# EAGLE design OpenLegDrive_G4 (EAGLE 9.6.2)

## Sheet 1 of 5
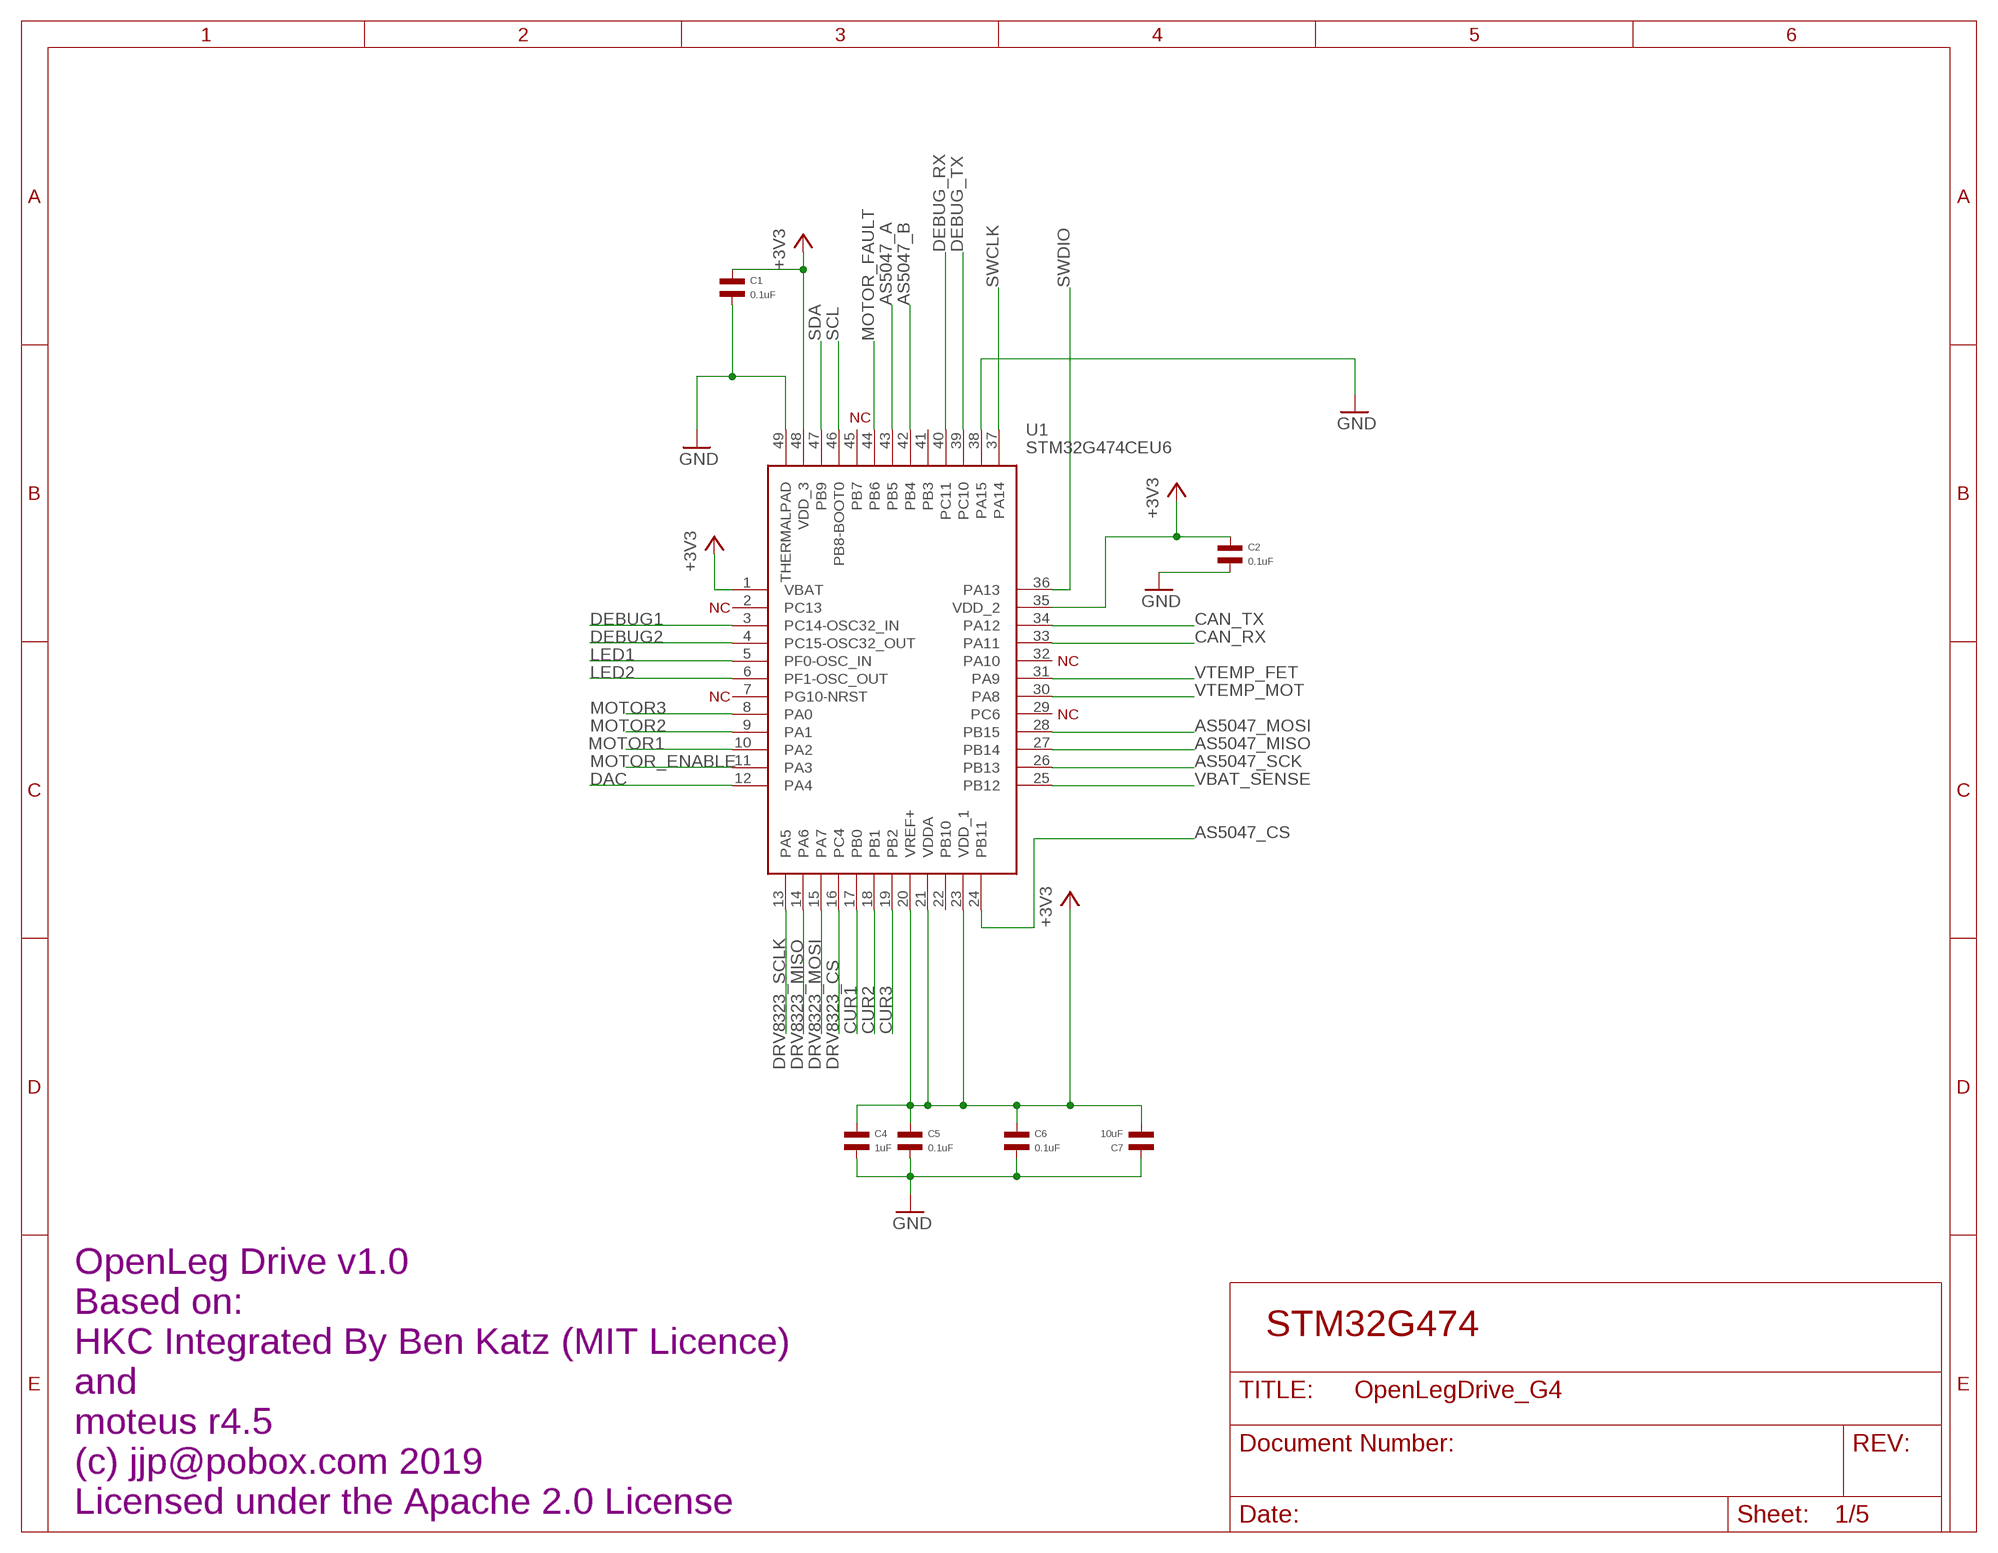
[diagram p0: schematic, sheet 1]

### Parts
C1  0.1uF  CAPACITOR_NP_0402  [C0402]
C2  0.1uF  CAPACITOR_NP_0402  [C0402]
C4  1uF  CAPACITOR_NP_0402  [C0402]
C5  0.1uF  CAPACITOR_NP_0402  [C0402]
C6  0.1uF  CAPACITOR_NP_0402  [C0402]
C7  10uF  CAPACITOR_NP_1206  [C1206]
U1  STM32G474CEU6  [QFN50P700X700X60-49N]

### Nets
3V3: C1.P$1 C2.P$1 C4.P$1 C5.P$1 C6.P$1 C7.P$2 U1.1(VBAT) U1.20(VREF+) U1.21(VDDA) U1.23(VDD_1) U1.35(VDD_2) U1.48(VDD_3) ; supply symbol labelled +3V3 ; also sheet 2,3,4,5
AS5047_A: U1.43(PB5) ; also sheet 4
AS5047_B: U1.42(PB4) ; also sheet 4
AS5047_CS: U1.24(PB11) ; also sheet 4
AS5047_MISO: U1.27(PB14) ; also sheet 4
AS5047_MOSI: U1.28(PB15) ; also sheet 4
AS5047_SCK: U1.26(PB13) ; also sheet 4
CAN_RX: U1.33(PA11) ; also sheet 3
CAN_TX: U1.34(PA12) ; also sheet 3
CUR1: U1.17(PB0) ; also sheet 2
CUR2: U1.18(PB1) ; also sheet 2
CUR3: U1.19(PB2) ; also sheet 2
DAC: U1.12(PA4)
DEBUG1: U1.3(PC14-OSC32_IN) ; also sheet 3
DEBUG2: U1.4(PC15-OSC32_OUT) ; also sheet 3
DEBUG_RX: U1.40(PC11) ; also sheet 3
DEBUG_TX: U1.39(PC10) ; also sheet 3
DRV8323_CS: U1.16(PC4) ; also sheet 2,3
DRV8323_MISO: U1.14(PA6) ; also sheet 2,3
DRV8323_MOSI: U1.15(PA7) ; also sheet 2,3
DRV8323_SCLK: U1.13(PA5) ; also sheet 2,3
GND: C1.P$2 C2.P$2 C4.P$2 C5.P$2 C6.P$2 C7.P$1 U1.38(PA15) U1.49(THERMALPAD) ; also sheet 2,3,4,5
LED1: U1.5(PF0-OSC_IN) ; also sheet 3
LED2: U1.6(PF1-OSC_OUT) ; also sheet 3
MOTOR1: U1.10(PA2) ; also sheet 2,3
MOTOR2: U1.9(PA1) ; also sheet 2,3
MOTOR3: U1.8(PA0) ; also sheet 2,3
MOTOR_ENABLE: U1.11(PA3) ; also sheet 2
MOTOR_FAULT: U1.44(PB6) ; also sheet 2
SCL: U1.46(PB8-BOOT0) ; also sheet 3
SDA: U1.47(PB9) ; also sheet 3
SWCLK: U1.37(PA14) ; also sheet 3
SWDIO: U1.36(PA13) ; also sheet 3
VBAT_SENSE: U1.25(PB12) ; also sheet 5
VTEMP_FET: U1.31(PA9) ; also sheet 5
VTEMP_MOT: U1.30(PA8) ; also sheet 5
Unconnected: U1.2(PC13) U1.7(PG10-NRST) U1.22(PB10) U1.29(PC6) U1.32(PA10) U1.41(PB3) U1.45(PB7)

### Notes on the sheet
- NC
- NC
- NC
- NC
- NC
- STM32G474
- OpenLeg Drive v1.0
  Based on:
  HKC Integrated By Ben Katz (MIT Licence)
  and
  moteus r4.5
  (c) jjp@pobox.com 2019
  Licensed under the Apache 2.0 License

## Sheet 2 of 5
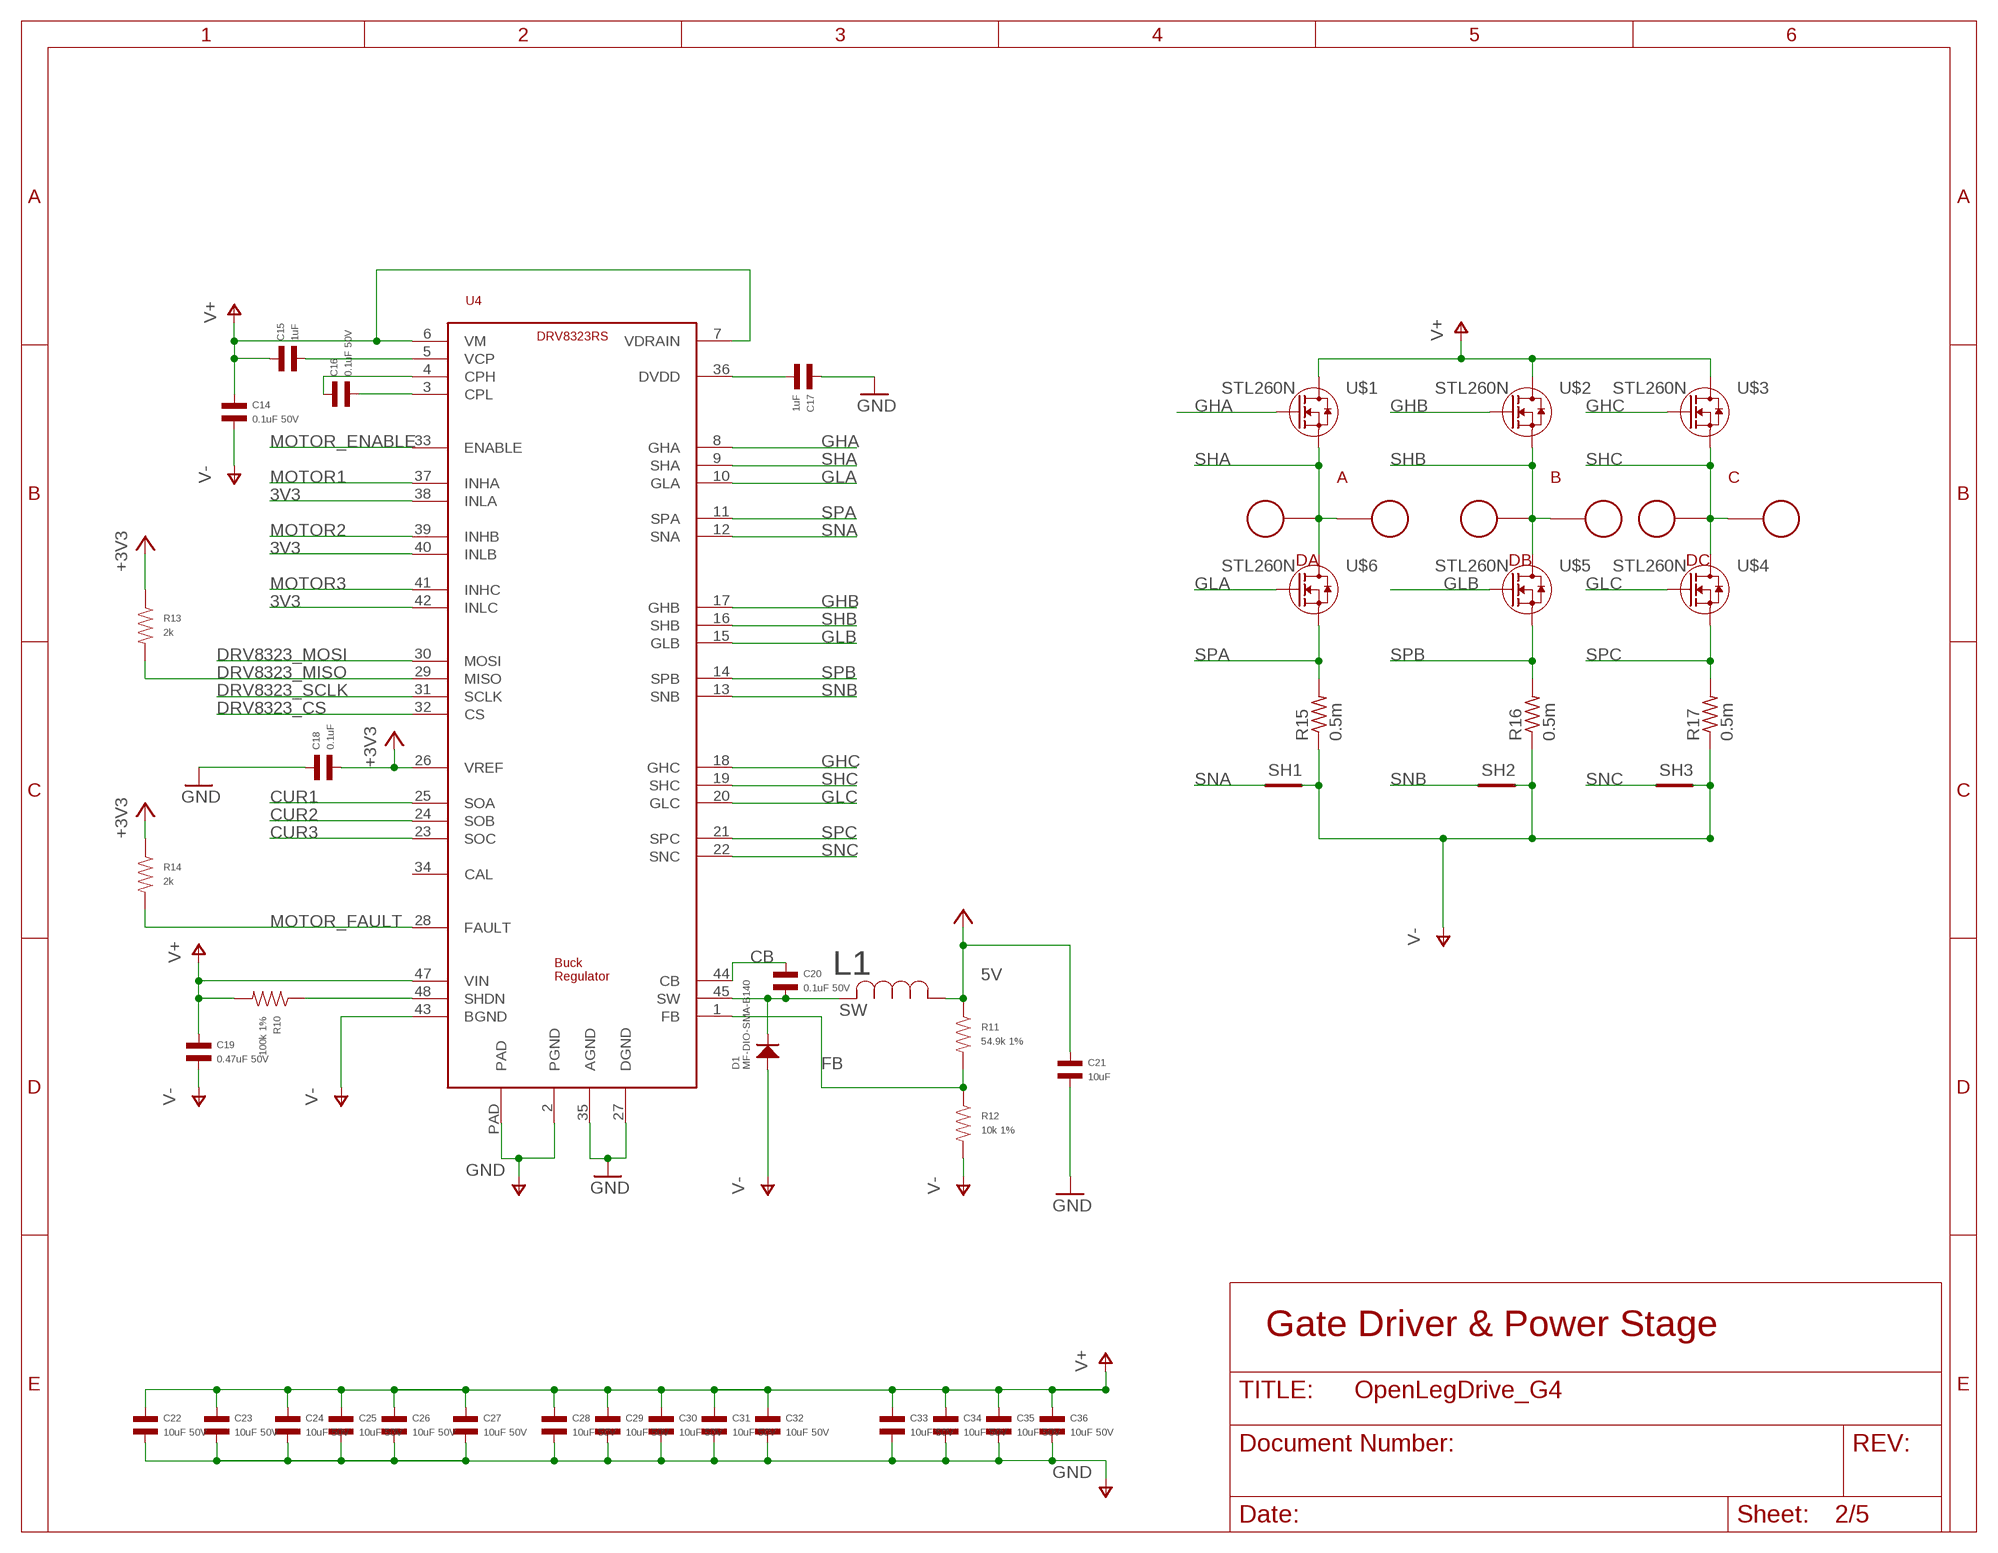
[diagram p1: schematic, sheet 2]

### Parts
A  PAD16AWG_PAD  [16AWG_PAD]
B  PAD16AWG_PAD  [16AWG_PAD]
C  PAD16AWG_PAD  [16AWG_PAD]
C14  0.1uF 50V  CAPACITOR_NP_0402  [C0402]
C15  1uF  CAPACITOR_NP_0402  [C0402]
C16  0.1uF 50V  CAPACITOR_NP_0402  [C0402]
C17  1uF  CAPACITOR_NP_0402  [C0402]
C18  0.1uF  CAPACITOR_NP_0402  [C0402]
C19  0.47uF 50V  CAPACITOR_NP_0402  [C0402]
C20  0.1uF 50V  CAPACITOR_NP_0402  [C0402]
C21  10uF  CAPACITOR_NP_1206  [C1206]
C22  10uF 50V  CAPACITOR_NP_1206  [C1206]
C23  10uF 50V  CAPACITOR_NP_1206  [C1206]
C24  10uF 50V  CAPACITOR_NP_1206  [C1206]
C25  10uF 50V  CAPACITOR_NP_1206  [C1206]
C26  10uF 50V  CAPACITOR_NP_1206  [C1206]
C27  10uF 50V  CAPACITOR_NP_1206  [C1206]
C28  10uF 50V  CAPACITOR_NP_1206  [C1206]
C29  10uF 50V  CAPACITOR_NP_1206  [C1206]
C30  10uF 50V  CAPACITOR_NP_1206  [C1206]
C31  10uF 50V  CAPACITOR_NP_1206  [C1206]
C32  10uF 50V  CAPACITOR_NP_1206  [C1206]
C33  10uF 50V  CAPACITOR_NP_1206  [C1206]
C34  10uF 50V  CAPACITOR_NP_1206  [C1206]
C35  10uF 50V  CAPACITOR_NP_1206  [C1206]
C36  10uF 50V  CAPACITOR_NP_1206  [C1206]
D1  MF-DIO-SMA-B140  DIODES_B140_SMA  [SMA]
DA  PAD24AWG_PAD  [24AWG_PAD]
DB  PAD24AWG_PAD  [24AWG_PAD]
DC  PAD24AWG_PAD  [24AWG_PAD]
L1  SRN4018-220M  [IND_BOURNS_SRN4018]
R10  100k 1%  RESISTOR_0402  [R0402]
R11  54.9k 1%  RESISTOR_0402  [R0402]
R12  10k 1%  RESISTOR_0402  [R0402]
R13  2k  RESISTOR_0402  [R0402]
R14  2k  RESISTOR_0402  [R0402]
R15  0.5m  R-US_R1210  [R1210]
R16  0.5m  R-US_R1210  [R1210]
R17  0.5m  R-US_R1210  [R1210]
SH1  SHORTT5  [SHORT_TOP-50]
SH2  SHORTT5  [SHORT_TOP-50]
SH3  SHORTT5  [SHORT_TOP-50]
U4  DRV8323RS  [PVQFN-N48]
U$1  STL260N  [POWERFLAT_5X6]
U$2  STL260N  [POWERFLAT_5X6]
U$3  STL260N  [POWERFLAT_5X6]
U$4  STL260N  [POWERFLAT_5X6]
U$5  STL260N  [POWERFLAT_5X6]
U$6  STL260N  [POWERFLAT_5X6]

### Nets
3V3: C18.P$2 R13.P$1 R14.P$1 U4.26(VREF) U4.38(INLA) U4.40(INLB) U4.42(INLC) ; supply symbol labelled +3V3 ; also sheet 1,3,4,5
5V: C21.P$1 L1.1 R11.P$1 ; supply symbol labelled +3V3 ; also sheet 3
CB: C20.P$1 U4.44(CB)
CUR1: U4.25(SOA) ; also sheet 1
CUR2: U4.24(SOB) ; also sheet 1
CUR3: U4.23(SOC) ; also sheet 1
DRV8323_CS: U4.32(CS) ; also sheet 1,3
DRV8323_MISO: R13.P$2 U4.29(MISO) ; also sheet 1,3
DRV8323_MOSI: U4.30(MOSI) ; also sheet 1,3
DRV8323_SCLK: U4.31(SCLK) ; also sheet 1,3
FB: R11.P$2 R12.P$1 U4.1(FB)
GHA: U4.8(GHA) U$1.4(G)
GHB: U4.17(GHB) U$2.4(G)
GHC: U4.18(GHC) U$3.4(G)
GLA: U4.10(GLA) U$6.4(G)
GLB: U4.15(GLB) U$5.4(G)
GLC: U4.20(GLC) U$4.4(G)
GND: C14.P$2 C17.P$1 C18.P$1 C19.P$2 C21.P$2 C22.P$2 C23.P$2 C24.P$2 C25.P$2 C26.P$2 C27.P$2 C28.P$2 C29.P$2 C30.P$2 C31.P$2 C32.P$2 C33.P$2 C34.P$2 C35.P$2 C36.P$2 D1.ANODE R12.P$2 R15.1 R16.1 R17.1 SH1.2 SH2.2 SH3.2 U4.2(PGND) U4.27(DGND) U4.35(AGND) U4.43(BGND) U4.PAD ; supply symbol labelled V- ; also sheet 1,3,4,5
MOTOR1: U4.37(INHA) ; also sheet 1,3
MOTOR2: U4.39(INHB) ; also sheet 1,3
MOTOR3: U4.41(INHC) ; also sheet 1,3
MOTOR_ENABLE: U4.33(ENABLE) ; also sheet 1
MOTOR_FAULT: R14.P$2 U4.28(FAULT) ; also sheet 1
N$5: R10.P$1 U4.48(SHDN)
N$10: C16.P$2 U4.3(CPL)
N$13: C16.P$1 U4.4(CPH)
N$14: C15.P$2 U4.5(VCP)
N$16: C17.P$2 U4.36(DVDD)
SHA: A.1 DA.P$1 U4.9(SHA) U$1.1(S) U$1.2(S) U$1.3(S) U$6.5(D) U$6.6(D) U$6.7(D) U$6.8(D)
SHB: B.1 DB.P$1 U4.16(SHB) U$2.1(S) U$2.2(S) U$2.3(S) U$5.5(D) U$5.6(D) U$5.7(D) U$5.8(D)
SHC: C.1 DC.P$1 U4.19(SHC) U$3.1(S) U$3.2(S) U$3.3(S) U$4.5(D) U$4.6(D) U$4.7(D) U$4.8(D)
SNA: SH1.1 U4.12(SNA)
SNB: SH2.1 U4.13(SNB)
SNC: SH3.1 U4.22(SNC)
SPA: R15.2 U4.11(SPA) U$6.1(S) U$6.2(S) U$6.3(S)
SPB: R16.2 U4.14(SPB) U$5.1(S) U$5.2(S) U$5.3(S)
SPC: R17.2 U4.21(SPC) U$4.1(S) U$4.2(S) U$4.3(S)
SW: C20.P$2 D1.CATHODE L1.2 U4.45(SW)
V+: C14.P$1 C15.P$1 C19.P$1 C22.P$1 C23.P$1 C24.P$1 C25.P$1 C26.P$1 C27.P$1 C28.P$1 C29.P$1 C30.P$1 C31.P$1 C32.P$1 C33.P$1 C34.P$1 C35.P$1 C36.P$1 R10.P$2 U4.6(VM) U4.7(VDRAIN) U4.47(VIN) U$1.5(D) U$1.6(D) U$1.7(D) U$1.8(D) U$2.5(D) U$2.6(D) U$2.7(D) U$2.8(D) U$3.5(D) U$3.6(D) U$3.7(D) U$3.8(D) ; also sheet 3,5
Unconnected: U4.34(CAL)

### Notes on the sheet
- Gate Driver & Power Stage

## Sheet 3 of 5
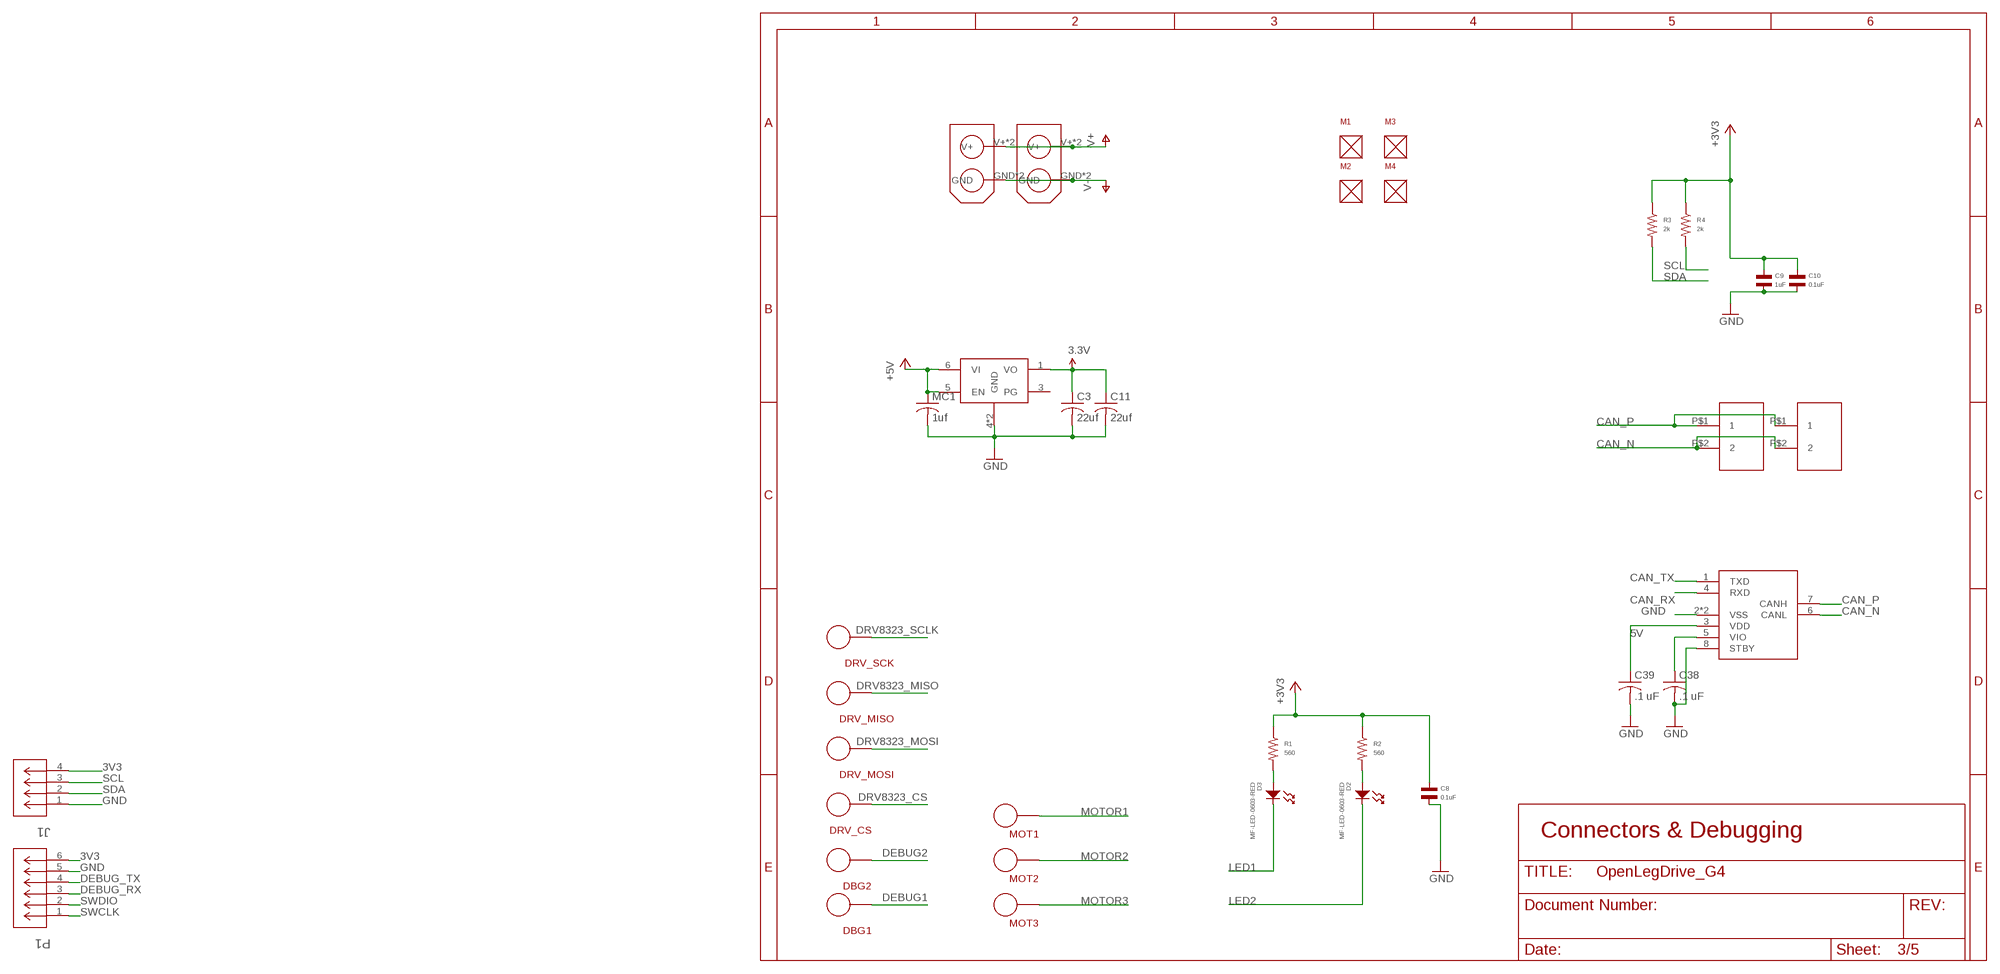
[diagram p2: schematic, sheet 3]

### Parts
C3  22uf  C-USC0603K  [C0603K]
C8  0.1uF  CAPACITOR_NP_0402  [C0402]
C9  1uF  CAPACITOR_NP_0402  [C0402]
C10  0.1uF  CAPACITOR_NP_0402  [C0402]
C11  22uf  C-USC0603K  [C0603K]
C38  .1 uF  C-USC0402K  [C0402K]
C39  .1 uF  C-USC0402K  [C0402K]
D2  MF-LED-0603-RED  LED_SINGLE-0603-RED  [LED0603]
D3  MF-LED-0603-RED  LED_SINGLE-0603-RED  [LED0603]
DBG1  PAD24AWG_PAD  [24AWG_PAD]
DBG2  PAD24AWG_PAD  [24AWG_PAD]
DRV_CS  PAD24AWG_PAD  [24AWG_PAD]
DRV_MISO  PAD24AWG_PAD  [24AWG_PAD]
DRV_MOSI  PAD24AWG_PAD  [24AWG_PAD]
DRV_SCK  PAD24AWG_PAD  [24AWG_PAD]
J1  S4B-ZR(LF)(SN)  [CONN_S4B-ZR(LF)(SN)_JST]
M1  MOUNT  [M2.5MOUNT]
M2  MOUNT  [M2.5MOUNT]
M3  MOUNT  [M2.5MOUNT]
M4  MOUNT  [M2.5MOUNT]
MC1  1uf  C-USC0402  [C0402]
MOT1  PAD24AWG_PAD  [24AWG_PAD]
MOT2  PAD24AWG_PAD  [24AWG_PAD]
MOT3  PAD24AWG_PAD  [24AWG_PAD]
P1  S6B-ZR(LF)(SN)  [S6B-ZR_JST]
R1  560  RESISTOR_0402  [R0402]
R2  560  RESISTOR_0402  [R0402]
R3  2k  RESISTOR_0402  [R0402]
R4  2k  RESISTOR_0402  [R0402]
U$7  XT30_DUAL_MOUNT_FLIPPED  [XT30_DUAL_FLIPPED]
U$8  XT30_DUAL_MOUNT  [XT30_DUAL]
U$9  JST-PH-DOUBLE-2-PIN  [JST-PH_DUALMOUNT-2]
U$10  JST-PH-DOUBLE-2-PIN  [JST-PH_DUALMOUNT-2]
U$11  LDFM  [DFN6-3X3]
U$12  MCP2542  [TDFN]

### Nets
3V3: C3.1 C8.P$1 C9.P$1 C10.P$1 C11.1 C38.1 J1.4 P1.6 R1.P$1 R2.P$1 R3.P$1 R4.P$1 U$11.1(VO) U$12.5(VIO) ; supply symbol labelled 3.3V, +3V3 ; also sheet 1,2,4,5
5V: C39.1 MC1.1 U$11.5(EN) U$11.6(VI) U$12.3(VDD) ; supply symbol labelled +5V ; also sheet 2
CAN_N [CAN]: U$9.P$2 U$10.P$2 U$12.6(CANL)
CAN_P [CAN]: U$9.P$1 U$10.P$1 U$12.7(CANH)
CAN_RX: U$12.4(RXD) ; also sheet 1
CAN_TX: U$12.1(TXD) ; also sheet 1
DEBUG1: DBG1.P$1 ; also sheet 1
DEBUG2: DBG2.P$1 ; also sheet 1
DEBUG_RX: P1.3 ; also sheet 1
DEBUG_TX: P1.4 ; also sheet 1
DRV8323_CS: DRV_CS.P$1 ; also sheet 1,2
DRV8323_MISO: DRV_MISO.P$1 ; also sheet 1,2
DRV8323_MOSI: DRV_MOSI.P$1 ; also sheet 1,2
DRV8323_SCLK: DRV_SCK.P$1 ; also sheet 1,2
GND: C3.2 C8.P$2 C9.P$2 C10.P$2 C11.2 C38.2 C39.2 J1.1 MC1.2 P1.5 U$7.GND U$7.GND@1(GND) U$8.GND U$8.GND@1(GND) U$11.4(GND) U$11.EXP(GND) U$12.2(VSS) U$12.8(STBY) U$12.9(VSS) ; supply symbol labelled V- ; also sheet 1,2,4,5
LED1: D3.CATHODE ; also sheet 1
LED2: D2.CATHODE ; also sheet 1
MOTOR1: MOT1.P$1 ; also sheet 1,2
MOTOR2: MOT2.P$1 ; also sheet 1,2
MOTOR3: MOT3.P$1 ; also sheet 1,2
N$17: D3.ANODE R1.P$2
N$18: D2.ANODE R2.P$2
SCL: J1.3 R4.P$2 ; also sheet 1
SDA: J1.2 R3.P$2 ; also sheet 1
SWCLK: P1.1 ; also sheet 1
SWDIO: P1.2 ; also sheet 1
V+: U$7.V+ U$7.V+@1(V+) U$8.V+ U$8.V+@1(V+) ; also sheet 2,5
Unconnected: U$11.3(PG)

### Notes on the sheet
- Connectors & Debugging

## Sheet 4 of 5
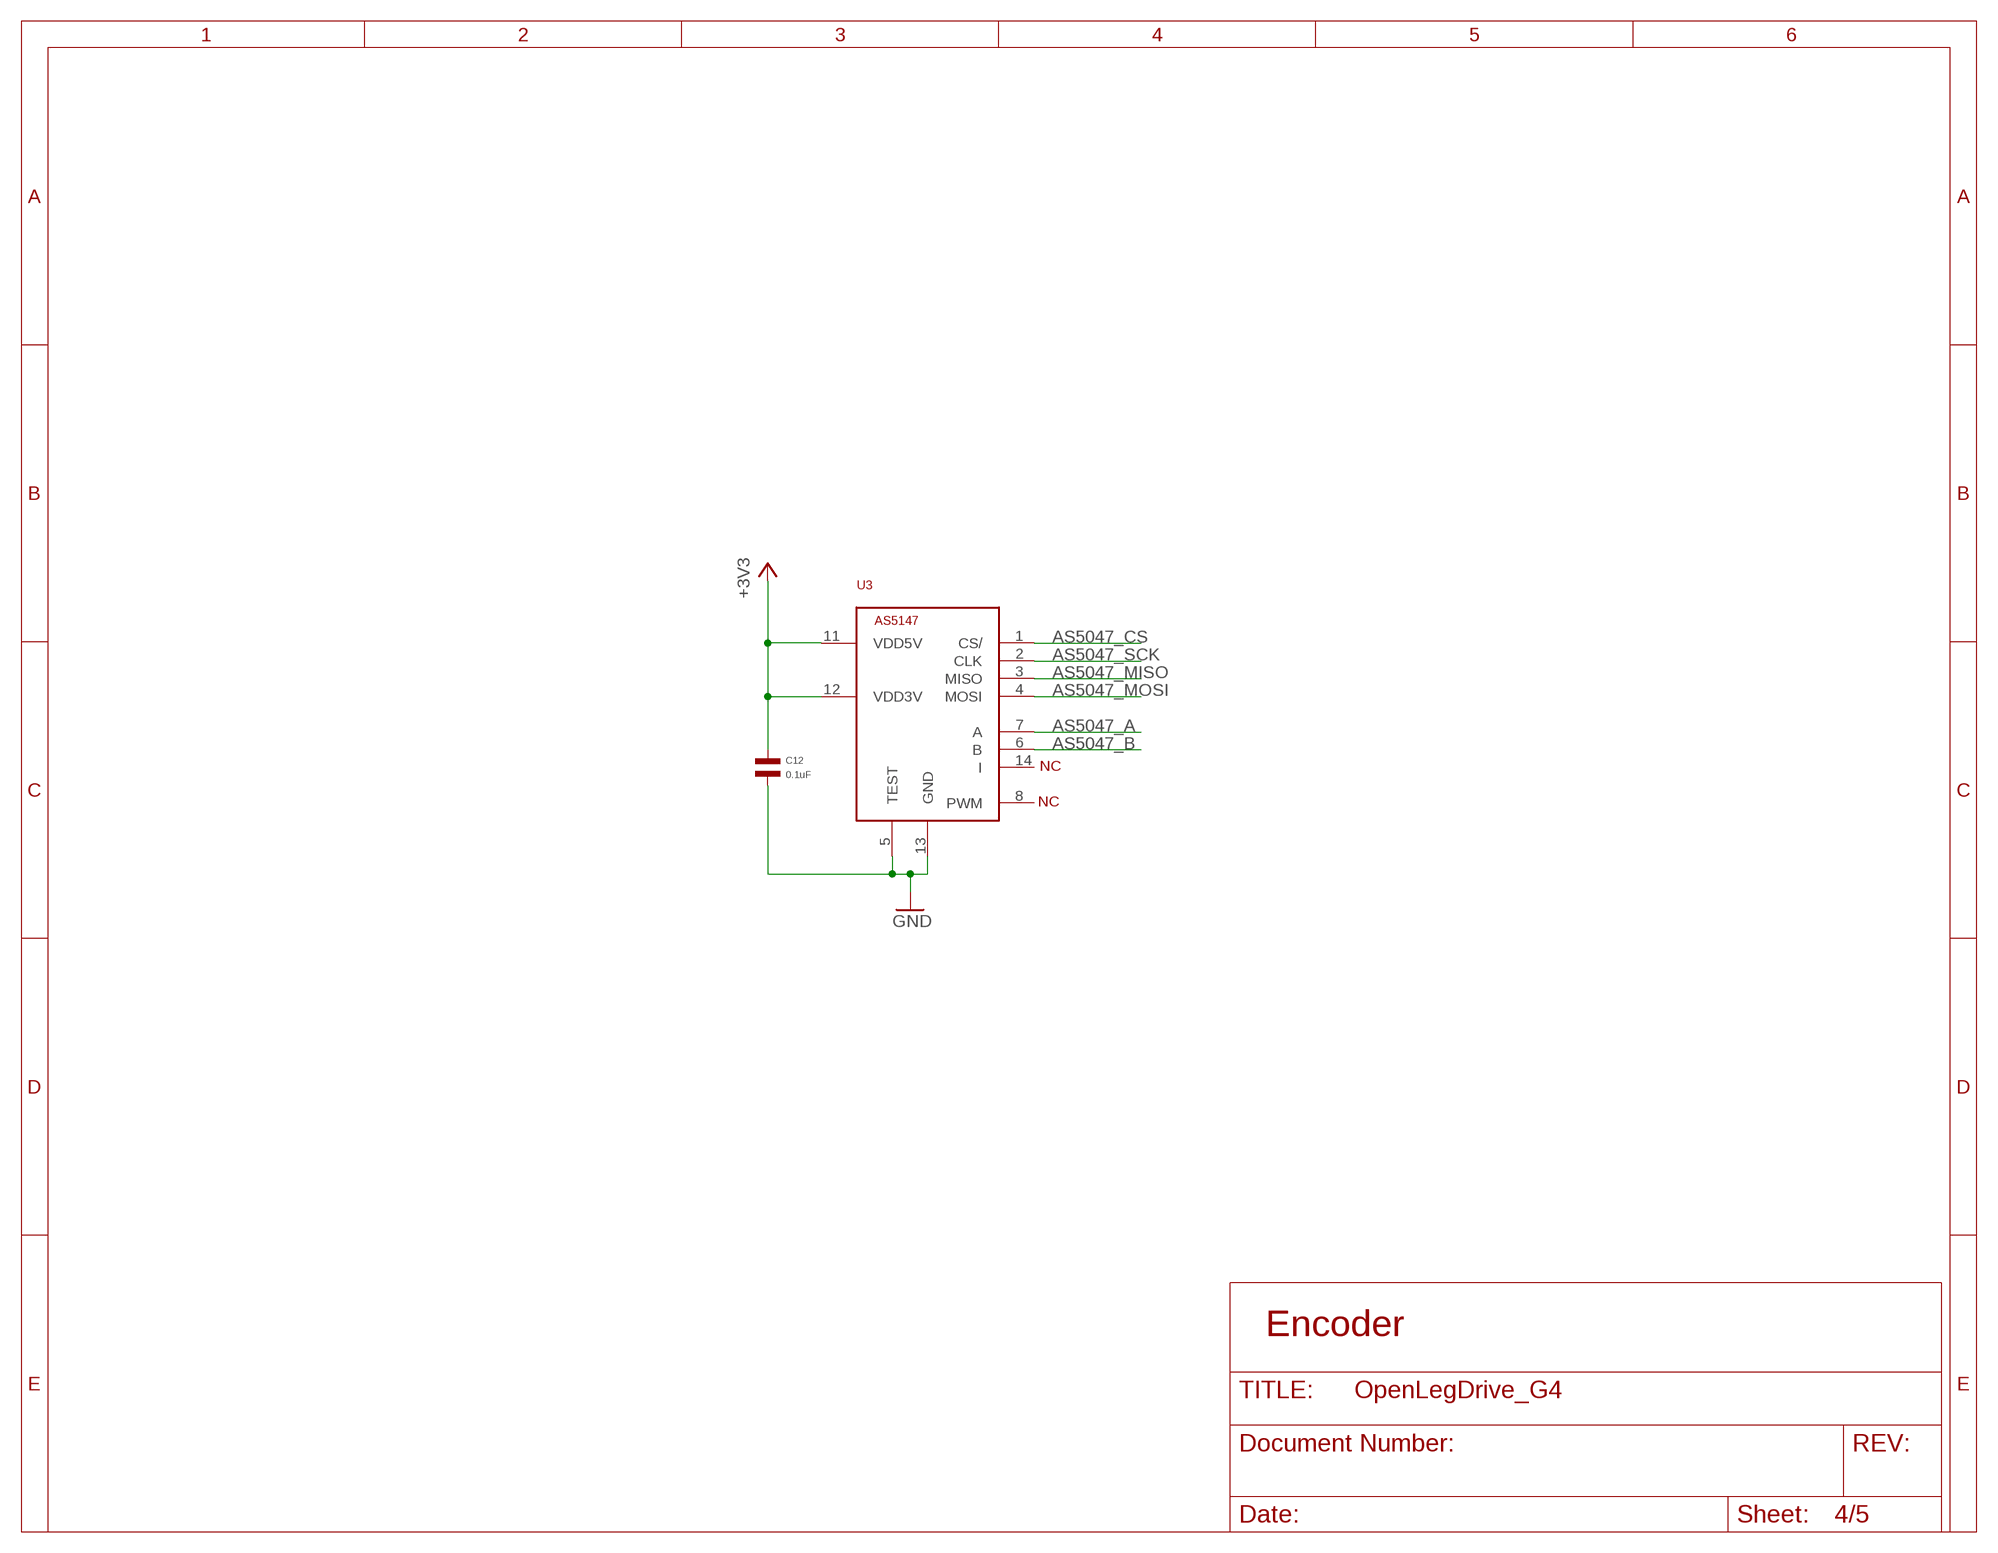
[diagram p3: schematic, sheet 4]

### Parts
C12  0.1uF  CAPACITOR_NP_0402  [C0402]
U3  AS5147  [TSSOP14]

### Nets
3V3: C12.P$1 U3.11(VDD5V) U3.12(VDD3V) ; supply symbol labelled +3V3 ; also sheet 1,2,3,5
AS5047_A: U3.7(A) ; also sheet 1
AS5047_B: U3.6(B) ; also sheet 1
AS5047_CS: U3.1(CS/) ; also sheet 1
AS5047_MISO: U3.3(MISO) ; also sheet 1
AS5047_MOSI: U3.4(MOSI) ; also sheet 1
AS5047_SCK: U3.2(CLK) ; also sheet 1
GND: C12.P$2 U3.5(TEST) U3.13(GND) ; also sheet 1,2,3,5
Unconnected: U3.8(PWM) U3.14(I)

### Notes on the sheet
- NC
- NC
- Encoder

## Sheet 5 of 5
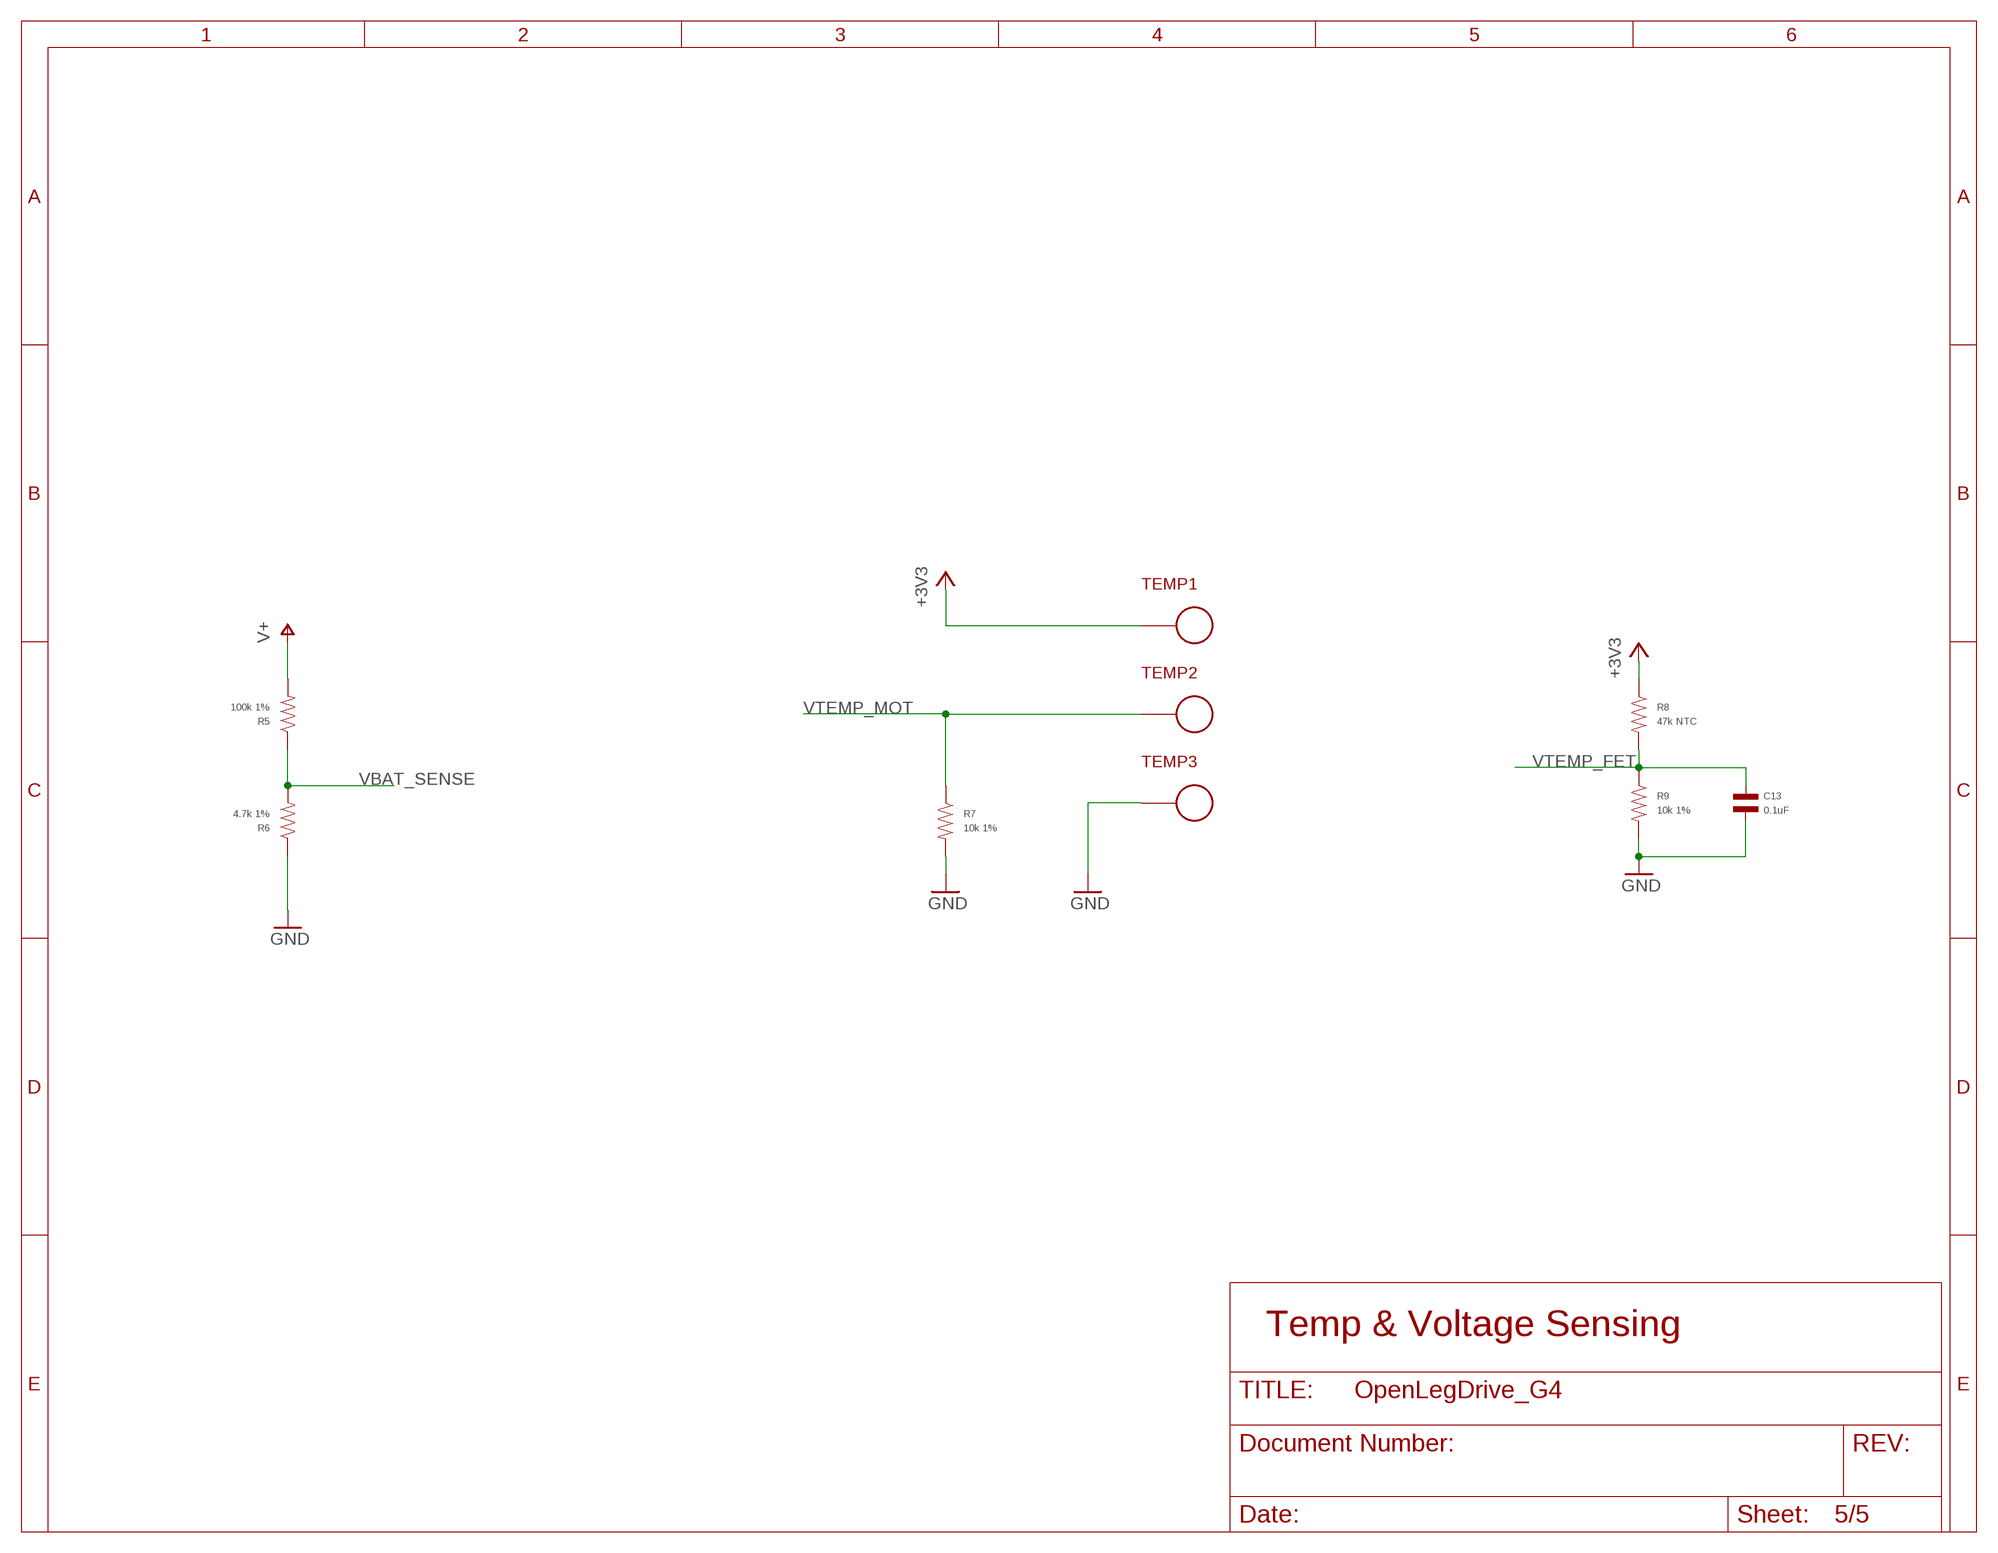
[diagram p4: schematic, sheet 5]

### Parts
C13  0.1uF  CAPACITOR_NP_0402  [C0402]
R5  100k 1%  RESISTOR_0402  [R0402]
R6  4.7k 1%  RESISTOR_0402  [R0402]
R7  10k 1%  RESISTOR_0402  [R0402]
R8  47k NTC  RESISTOR_0402  [R0402]
R9  10k 1%  RESISTOR_0402  [R0402]
TEMP1  PAD24AWG_PAD  [24AWG_PAD]
TEMP2  PAD24AWG_PAD  [24AWG_PAD]
TEMP3  PAD24AWG_PAD  [24AWG_PAD]

### Nets
3V3: R8.P$1 TEMP1.P$1 ; supply symbol labelled +3V3 ; also sheet 1,2,3,4
GND: C13.P$2 R6.P$1 R7.P$2 R9.P$2 TEMP3.P$1 ; also sheet 1,2,3,4
V+: R5.P$2 ; also sheet 2,3
VBAT_SENSE: R5.P$1 R6.P$2 ; also sheet 1
VTEMP_FET: C13.P$1 R8.P$2 R9.P$1 ; also sheet 1
VTEMP_MOT: R7.P$1 TEMP2.P$1 ; also sheet 1

### Notes on the sheet
- Temp & Voltage Sensing

## Library data of the parts
A B C DA DB DBG1 DBG2 DC DRV_CS DRV_MISO DRV_MOSI DRV_SCK MOT1-MOT3 TEMP1-TEMP3 = controller:PAD; POPULATE: 0
C1 C2 C5 C6 C8 C10 C12 C13 C18 = mfpassives:CAPACITOR_NP: Library: MF_Passives Description: Device for Non-Polarized Capacitors. Manufacture part number (MPN) can be added via Attributes. Check https://factory.macrofab.com/parts for the house parts list.; HOUSEPART: YES; MPN: MF-CAP-0402-0.1uF; POPULATE: 1
C3 C11 C38 C39 MC1 = rcl:C-US: CAPACITOR, American symbol; SPICEPREFIX: C
C4 C9 C15 C17 = mfpassives:CAPACITOR_NP: Library: MF_Passives Description: Device for Non-Polarized Capacitors. Manufacture part number (MPN) can be added via Attributes. Check https://factory.macrofab.com/parts for the house parts list.; HOUSEPART: YES; MPN: MF-CAP-0402-1uF; POPULATE: 1
C7 C21 = mfpassives:CAPACITOR_NP: Library: MF_Passives Description: Device for Non-Polarized Capacitors. Manufacture part number (MPN) can be added via Attributes. Check https://factory.macrofab.com/parts for the house parts list.; HOUSEPART: YES; MPN: MF-CAP-1206-10uF; POPULATE: 1
C14 C16 C20 = mfpassives:CAPACITOR_NP: Library: MF_Passives Description: Device for Non-Polarized Capacitors. Manufacture part number (MPN) can be added via Attributes. Check https://factory.macrofab.com/parts for the house parts list.; MF: TDK; MPN: CGA2B3X7R1H104K050BB; POPULATE: 1
C19 = mfpassives:CAPACITOR_NP: Library: MF_Passives Description: Device for Non-Polarized Capacitors. Manufacture part number (MPN) can be added via Attributes. Check https://factory.macrofab.com/parts for the house parts list.; MF: Taiyo Yuden; MPN: UMK105ABJ474KV-F; POPULATE: 1
C22-C36 = mfpassives:CAPACITOR_NP: Library: MF_Passives Description: Device for Non-Polarized Capacitors. Manufacture part number (MPN) can be added via Attributes. Check https://factory.macrofab.com/parts for the house parts list.; MF: TDK; MPN: C3216X7R1H106K160AE; POPULATE: 1
D1 = mfdiscretesemi:DIODES: Library: MF_Discrete_Semiconductor Description: Device for Single Packaged Diodes.; HOUSEPART: YES; MPN: MF-DIO-SMA-B140; POPULATE: 1; URL: https://factory.macrofab.com/part/MF-DIO-SMA-B140
D2 = mfleds:LED_SINGLE: Library: MF_LEDs Description: Device for Single LED Packages. Manufacture part number (MFG#) can be added via Attributes.; HOUSEPART: YES; MPN: MF-LED-0603-GREEN; POPULATE: 1; URL: https://factory.macrofab.com/part/MF-LED-0603-RED
D3 = mfleds:LED_SINGLE: Library: MF_LEDs Description: Device for Single LED Packages. Manufacture part number (MFG#) can be added via Attributes.; HOUSEPART: YES; MPN: MF-LED-0603-RED; POPULATE: 1; URL: https://factory.macrofab.com/part/MF-LED-0603-RED
J1 = controller:S4B-ZR(LF)(SN); BUILT_BY: EMA_Cory; COPYRIGHT: Copyright (C) 2018 Accelerated Designs. All rights reserved; MANUFACTURER_PART_NUMBER: S4B-ZR(LF)(SN); SOURCELIBRARY: JST_2019-12-02; VENDOR: JST
L1 = controller:SRN4018-220M; MANUFACTURER_PART_NUMBER: SRN4018220M; MPN: SRN4018-220M; POPULATE: 1; VENDOR: Bourns Electronics
M1-M4 = controller:MOUNT; POPULATE: 0
P1 = controller:S6B-ZR(LF)(SN); BUILT_BY: EMA_UL_Team; MANUFACTURER_PART_NUMBER: S6B-ZR(LF)(SN); SOURCELIBRARY: JST_2017-04-18; VENDOR: JST
R1 R2 = mfpassives:RESISTOR: Library: MF_Passives Description: Device for Resistors. Manufacture part number (MPN), Voltage, Tolerance, and Wattage Rating can be added via Attributes. Check https://factory.macrofab.com/parts for the house parts list.; HOUSEPART: 1; MPN: MF-RES-0402-560; POPULATE: 1
R3 R4 R13 R14 = mfpassives:RESISTOR: Library: MF_Passives Description: Device for Resistors. Manufacture part number (MPN), Voltage, Tolerance, and Wattage Rating can be added via Attributes. Check https://factory.macrofab.com/parts for the house parts list.; HOUSEPART: YES; MPN: MF-RES-0402-2K; POPULATE: 1
R5 R10 = mfpassives:RESISTOR: Library: MF_Passives Description: Device for Resistors. Manufacture part number (MPN), Voltage, Tolerance, and Wattage Rating can be added via Attributes. Check https://factory.macrofab.com/parts for the house parts list.; MF: Panasonic; MPN: ERJ-2RKF1003X; POPULATE: 1
R6 = mfpassives:RESISTOR: Library: MF_Passives Description: Device for Resistors. Manufacture part number (MPN), Voltage, Tolerance, and Wattage Rating can be added via Attributes. Check https://factory.macrofab.com/parts for the house parts list.; MF: Panasonic; MPN: ERJ-2RKF4701X; POPULATE: 1
R7 R9 R12 = mfpassives:RESISTOR: Library: MF_Passives Description: Device for Resistors. Manufacture part number (MPN), Voltage, Tolerance, and Wattage Rating can be added via Attributes. Check https://factory.macrofab.com/parts for the house parts list.; MF: Panasonic; MPN: ERJ-2RKF1002X; POPULATE: 1
R8 = mfpassives:RESISTOR: Library: MF_Passives Description: Device for Resistors. Manufacture part number (MPN), Voltage, Tolerance, and Wattage Rating can be added via Attributes. Check https://factory.macrofab.com/parts for the house parts list.; MF: Murata; MPN: NCP15WB473F03RC; POPULATE: 1
R11 = mfpassives:RESISTOR: Library: MF_Passives Description: Device for Resistors. Manufacture part number (MPN), Voltage, Tolerance, and Wattage Rating can be added via Attributes. Check https://factory.macrofab.com/parts for the house parts list.; MF: Panasonic; MPN: ERJ-2RKF3302X; POPULATE: 1
R15-R17 = rcl:R-US_: RESISTOR, American symbol; SPICEPREFIX: R
SH1-SH3 = shorts:SHORT: Short between two nets; BOM: no; POPULATE: 0
U1 = controller:STM32G474CEU6: STMICROELECTRONICS - STM32G474CEU6 - MCU, 32BIT, 170MHZ, UFQFPN-48 Source: Datasheet <https://componentsearchengine.com/Datasheets/1/STM32G474CEU6.pdf>; DESCRIPTION: STMICROELECTRONICS - STM32G474CEU6 - MCU, 32BIT, 170MHZ, UFQFPN-48; HEIGHT: 0.6mm; MANUFACTURER_NAME: STMicroelectronics; MANUFACTURER_PART_NUMBER: STM32G474CEU6; MOUSER_PART_NUMBER: 511-STM32G474CEU6; MOUSER_PRICE-STOCK: https://www.mouser.com/Search/Refine.aspx?Keyword=511-STM32G474CEU6; MPN: STM32G474CEU6; POPULATE: 1
U3 = controller:AS5147; MF: AMS; MPN: AS5047P-ATSM; POPULATE: 1
U4 = controller:DRV8323RS; MF: TI; MPN: DRV8323RSRGZR; POPULATE: 1
U$1-U$6 = ByrnesFOC:STL260N
U$7 = JoeyMotorDrive:XT30_DUAL_MOUNT_FLIPPED
U$8 = JoeyMotorDrive:XT30_DUAL_MOUNT
U$9 U$10 = JoeyMotorDrive:JST-PH-DOUBLE-2-PIN
U$11 = BenLibrary:LDFM
U$12 = BenLibrary:MCP2542

## Net classes
1 CAN: width 0.127 mm, clearance 0.254 mm

## Board
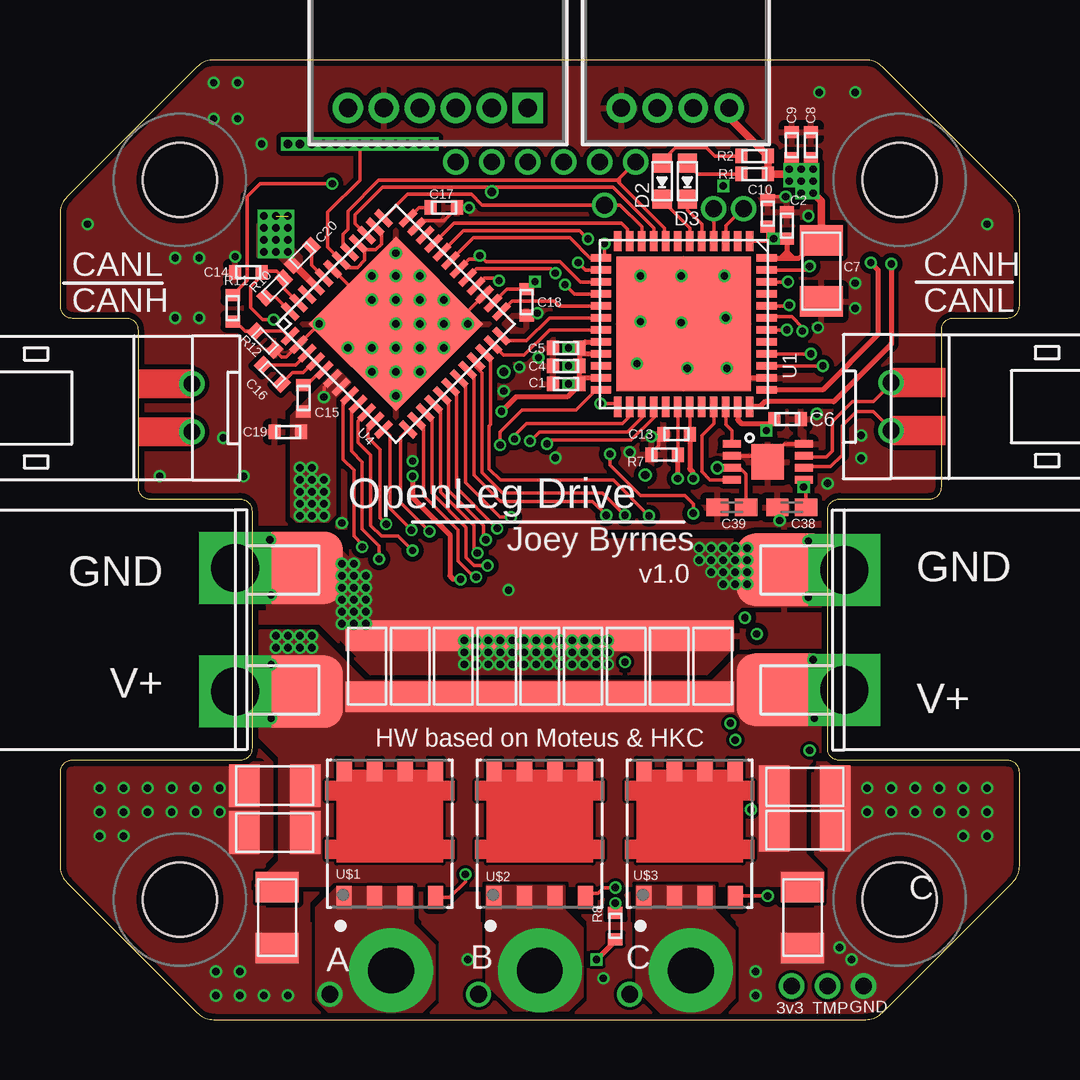
[diagram p5: board, top side]
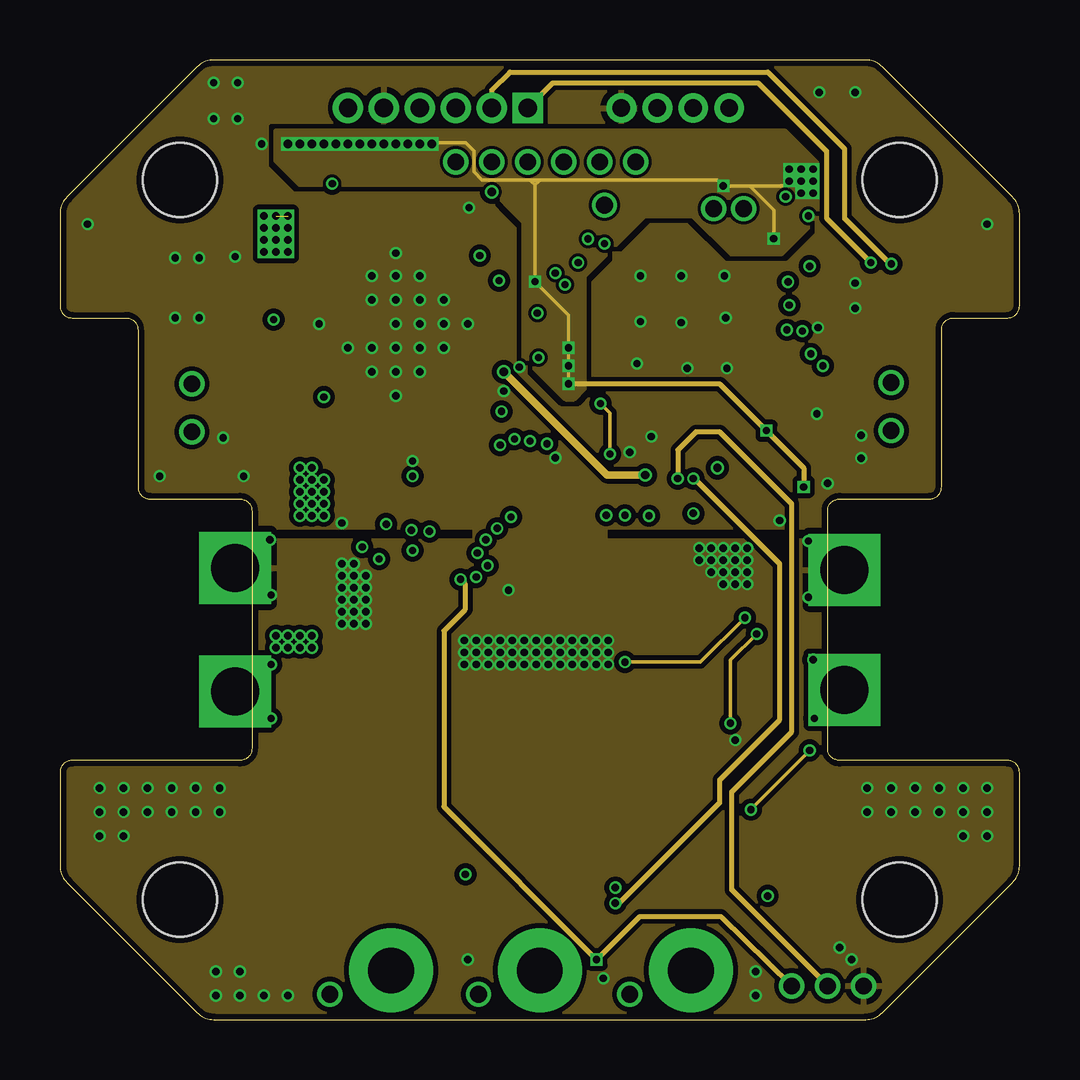
[diagram p6: board, inner layer Route2]
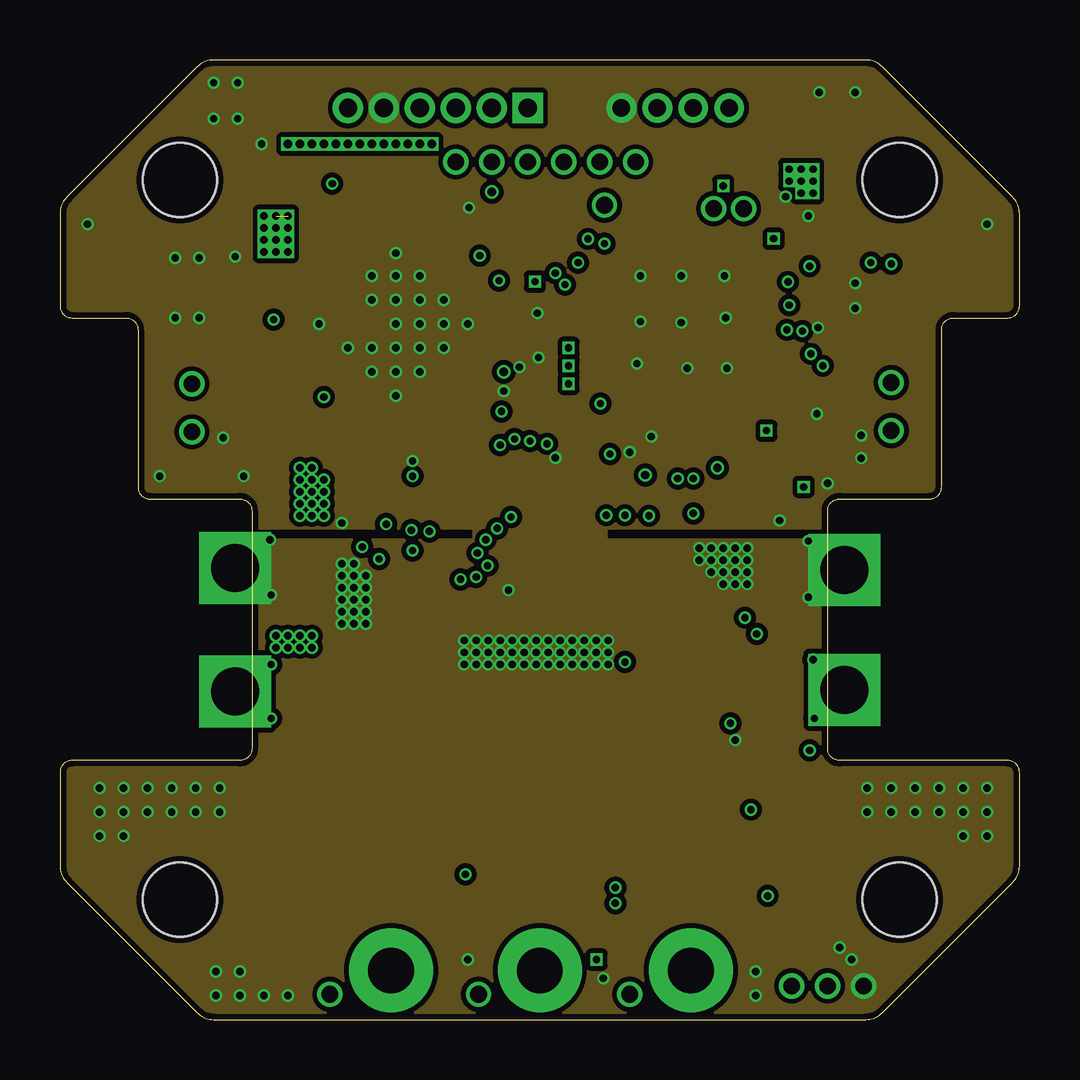
[diagram p7: board, inner layer Route15]
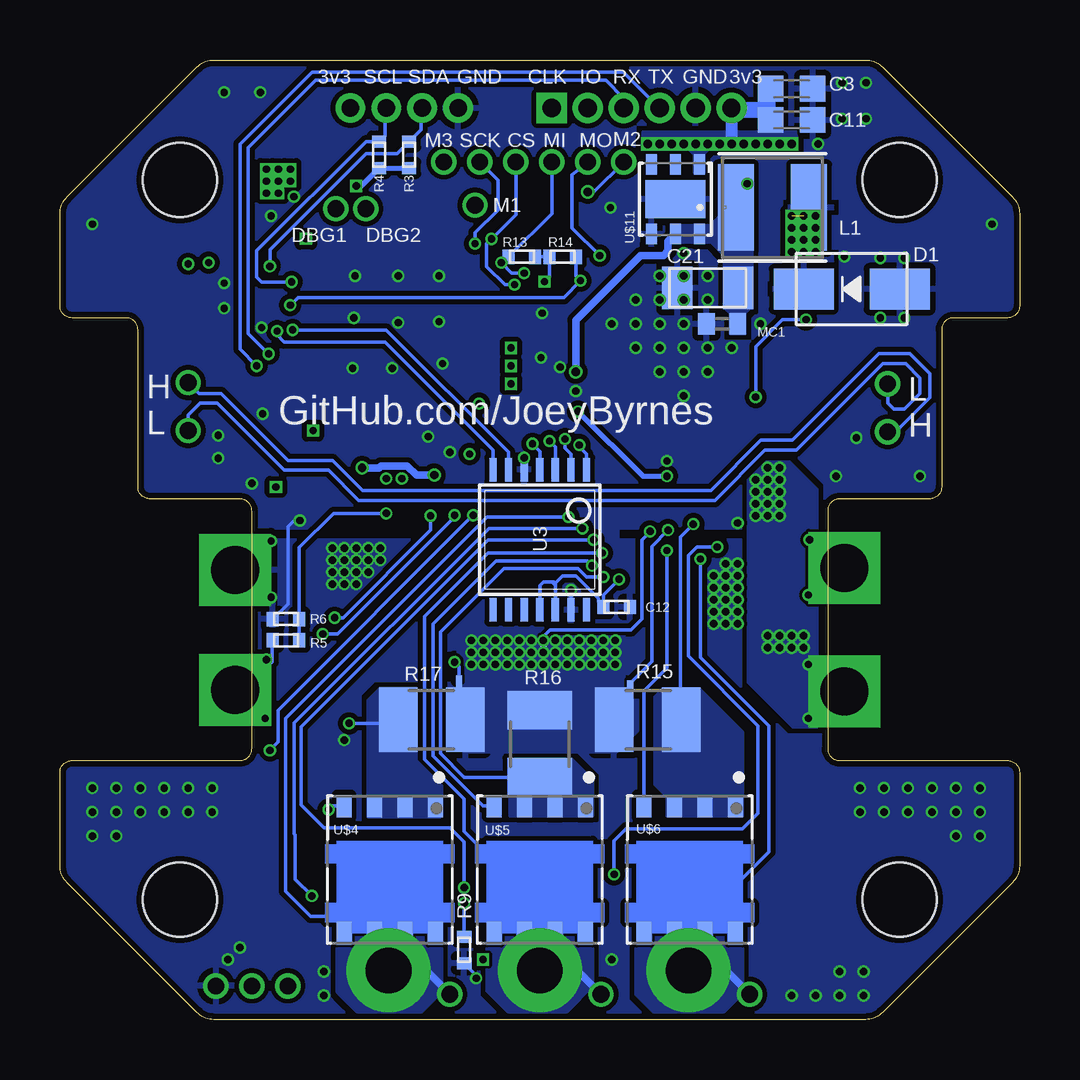
[diagram p8: board, bottom side, seen from below]

Size 40 x 40 mm. Coordinates in mm from the lower left corner, seen from the top.
Outline: 40,6.41 40,10.3 arc90 39.5,10.8 32.5,10.8 arc-90 32,11.3 32,21.2 arc-90 32.5,21.7 36.25,21.7 arc90 36.75,22.2 36.75,28.75 arc-90 37.25,29.25 39.5,29.25 arc90 40,29.75 40,33.59 arc45 39.71,34.29 34.29,39.71 arc45 33.59,40 6.41,40 arc45 5.71,39.71 0.29,34.29 arc45 0,33.59 0,29.75 arc90 0.5,29.25 2.75,29.25 arc-90 3.25,28.75 3.25,22.2 arc90 3.75,21.7 7.5,21.7 arc-90 8,21.2 8,11.3 arc-90 7.5,10.8 0.5,10.8 arc90 0,10.3 0,6.41 arc45 0.29,5.71 5.71,0.29 arc45 6.41,0 33.59,0 arc45 34.29,0.29 39.71,5.71 arc45 40,6.41
Copper layers (1+2+15+16): Top 0.035mm / dielectric 0.23mm / Route2 0.035mm / dielectric 0.93mm / Route15 0.035mm / dielectric 0.23mm / Bottom 0.035mm
Design rules "MF_4_mil_drill_4_Layer *": minimum track width 5mil, minimum drill 4mil, track to track 5mil, track to pad 5mil, pad to pad 5mil, via to via 5mil, smd to smd 0mil, copper to edge 10mil, drill to drill 10mil, minimum pad ring 4mil, minimum via ring 4mil, stop-mask expansion 2mil, vias tented up to drill 25mil, thermal gap 10mil

### Footprints (pad centres in the part's own frame; a part is rotated, then mirrored left to right if it is on the bottom)
16AWG_PAD = drill 1.9 pad 3.5: 1 0,0
C0402 = smd 0.5 x 0.6: P$1 -0.55,0; P$2 0.55,0
C0603K = smd 1.05 x 1.08: 1 -0.875,0; 2 0.875,0
C1206 = smd 1.27 x 1.778: P$1 -1.27,0; P$2 1.27,0
C0402K = smd 0.925 x 0.74: 1 -0.6,0; 2 0.6,0
SMA = smd 2.5 x 1.7: ANODE 2,0; CATHODE -2,0
LED0603 = smd 0.8 x 0.8: ANODE 0.75,0; CATHODE -0.75,0
24AWG_PAD = drill 0.7: P$1 0,0
CONN_S4B-ZR(LF)(SN)_JST = drill 0.737 pad 1.245: 1 0,0; 2 -1.499,0; 3 -2.997,0; 4 -4.496,0
IND_BOURNS_SRN4018 = smd 1.499 x 3.607: 1 -1.524,0; 2 1.524,0
M2.5MOUNT = hole 3.1: 0,0
C0402' = smd 0.7 x 0.9: 1 -0.65,0; 2 0.65,0
S6B-ZR_JST = drill 0.762 pad 1.27 square: 1 0,0 | drill 0.762 pad 1.27: 2 1.499,0; 3 2.997,0; 4 4.496,0; 5 5.994,0; 6 7.493,0
R0402 = smd 0.5 x 0.6: P$1 -0.55,0; P$2 0.55,0
R1210 = smd 1.6 x 2.7: 1 -1.4,0; 2 1.4,0
SHORT_TOP-50 = smd 0.254 x 0.254: 1 0.127,0; 2 -0.127,0
QFN50P700X700X60-49N = smd 0.85 x 0.3: 1 -3.45,2.75; 2 -3.45,2.25; 3 -3.45,1.75; 4 -3.45,1.25; 5 -3.45,0.75; 6 -3.45,0.25; 7 -3.45,-0.25; 8 -3.45,-0.75; 9 -3.45,-1.25; 10 -3.45,-1.75; 11 -3.45,-2.25; 12 -3.45,-2.75; 25 3.45,-2.75; 26 3.45,-2.25; 27 3.45,-1.75; 28 3.45,-1.25; 29 3.45,-0.75; 30 3.45,-0.25; 31 3.45,0.25; 32 3.45,0.75; 33 3.45,1.25; 34 3.45,1.75; 35 3.45,2.25; 36 3.45,2.75 | smd 0.3 x 0.85: 13 -2.75,-3.45; 14 -2.25,-3.45; 15 -1.75,-3.45; 16 -1.25,-3.45; 17 -0.75,-3.45; 18 -0.25,-3.45; 19 0.25,-3.45; 20 0.75,-3.45; 21 1.25,-3.45; 22 1.75,-3.45; 23 2.25,-3.45; 24 2.75,-3.45; 37 2.75,3.45; 38 2.25,3.45; 39 1.75,3.45; 40 1.25,3.45; 41 0.75,3.45; 42 0.25,3.45; 43 -0.25,3.45; 44 -0.75,3.45; 45 -1.25,3.45; 46 -1.75,3.45; 47 -2.25,3.45; 48 -2.75,3.45 | smd 5.6 x 5.6: 49 0,0
TSSOP14 = smd 0.305 x 0.991: 1 -1.95,-2.918; 2 -1.3,-2.918; 3 -0.65,-2.918; 4 0,-2.918; 5 0.65,-2.918; 6 1.3,-2.918; 7 1.95,-2.918; 8 1.95,2.918; 9 1.3,2.918; 10 0.65,2.918; 11 0,2.918; 12 -0.65,2.918; 13 -1.3,2.918; 14 -1.95,2.918
PVQFN-N48 = smd 0.28 x 0.85: 1 2.75,3.475; 2 2.25,3.475; 3 1.75,3.475; 4 1.25,3.475; 5 0.75,3.475; 6 0.25,3.475; 7 -0.25,3.475; 8 -0.75,3.475; 9 -1.25,3.475; 10 -1.75,3.475; 11 -2.25,3.475; 12 -2.75,3.475; 25 -2.75,-3.475; 26 -2.25,-3.475; 27 -1.75,-3.475; 28 -1.25,-3.475; 29 -0.75,-3.475; 30 -0.25,-3.475; 31 0.25,-3.475; 32 0.75,-3.475; 33 1.25,-3.475; 34 1.75,-3.475; 35 2.25,-3.475; 36 2.75,-3.475 | smd 0.85 x 0.28: 13 -3.475,2.75; 14 -3.475,2.25; 15 -3.475,1.75; 16 -3.475,1.25; 17 -3.475,0.75; 18 -3.475,0.25; 19 -3.475,-0.25; 20 -3.475,-0.75; 21 -3.475,-1.25; 22 -3.475,-1.75; 23 -3.475,-2.25; 24 -3.475,-2.75; 37 3.475,-2.75; 38 3.475,-2.25; 39 3.475,-1.75; 40 3.475,-1.25; 41 3.475,-0.75; 42 3.475,-0.25; 43 3.475,0.25; 44 3.475,0.75; 45 3.475,1.25; 46 3.475,1.75; 47 3.475,2.25; 48 3.475,2.75 | smd 5.15 x 5.15: PAD 0,0
POWERFLAT_5X6 = smd 0.94 x 0.62: 1 -2.655,1.905; 2 -2.655,0.635; 3 -2.655,-0.635; 4 -2.655,-1.905; 5 2.655,-1.905; 6 2.655,-0.635; 7 2.655,0.635; 8 2.655,1.905
XT30_DUAL_FLIPPED = smd 4 x 3: GND 0,-2.58; V+ 0,2.58 | drill 2 pad 3 square: GND@1 2.5,-2.58; V+@1 2.5,2.58
XT30_DUAL = smd 4 x 3: GND 0,2.5; V+ 0,-2.5 | drill 2 pad 3 square: GND@1 2.5,2.5; V+@1 2.5,-2.5
JST-PH_DUALMOUNT-2 = drill 0.7: P$1 0,0; P$2 0,-2
DFN6-3X3 = smd 0.85 x 0.45: 1 -1.45,1; 2 -1.45,0; 3 -1.45,-1; 4 1.45,-1; 5 1.45,0; 6 1.45,1 | smd 1.6 x 2.5: EXP 0,0
TDFN = smd 0.3 x 0.75: 1 0,-3; 2 0.5,-3; 3 1,-3; 4 1.5,-3; 5 1.5,0; 6 1,0; 7 0.5,0; 8 0,0 | smd 1.46 x 1.36: 9 0.75,-1.5

### Placement (x,y rotation side)
A  13.8,2.05 0 top
B  20,2.05 0 top
C  26.3,2.05 0 top
C1  21.1,26.5 180 top
C2  30.3,33.1 90 top
C3  9.5,38.8 0 bottom
C4  21.1,27.25 180 top
C5  21.1,28 180 top
C6  30.33,25.03 0 top
C7  31.74,31.2 90 top
C8  31.3,36.45 90 top
C9  30.5,36.45 90 top
C10  29.5,33.6 90 top
C11  9.5,37.5 0 bottom
C12  16.8,17.2 0 bottom
C13  25.7,24.4 180 top
C14  7.85,31.15 180 top
C15  10.15,25.9 90 top
C16  8.85,26.9 135 top
C17  16,33.85 180 top
C18  19.45,29.9 90 top
C19  9.5,24.5 180 top
C20  10.1,31.85 225 top
C21  13,30.5 180 bottom
C22  12.8,14.73 90 top
C23  14.6,14.73 90 top
C24  16.4,14.73 90 top
C25  18.2,14.73 90 top
C26  20,14.73 90 top
C27  21.8,14.73 90 top
C28  23.6,14.73 90 top
C29  25.4,14.73 90 top
C30  27.2,14.73 90 top
C31  31.05,9.7 0 top
C32  31.05,7.9 0 top
C33  8.95,9.75 180 top
C34  8.95,7.8 180 top
C35  9.05,4.25 270 top
C36  30.95,4.25 270 top
C38  30.5,21.35 180 top
C39  28,21.35 180 top
D1  7,30.45 0 bottom
D2  25.1,34.95 90 top
D3  26.15,34.95 90 top
DA  11.25,1.05 0 top
DB  17.45,1.05 0 top
DBG1  28.5,33.8 270 top
DBG2  27.25,33.8 270 top
DC  23.75,1.05 0 top
DRV_CS  21,35.75 0 top
DRV_MISO  19.5,35.75 0 top
DRV_MOSI  18,35.75 0 top
DRV_SCK  22.5,35.75 0 top
J1  23.4,38 180 top
L1  10.3,33.85 0 bottom
M1  5,35 0 top
M2  35,35 0 top
M3  5,5 0 top
M4  35,5 0 top
MC1  1uf  [C0402']  12.4,29 180 bottom
MOT1  22.7,33.95 0 top
MOT2  16.5,35.75 0 top
MOT3  24,35.75 0 top
P1  19.5,38 180 top
R1  28.95,35.25 180 top
R2  28.95,36 180 top
R3  25.45,36.05 90 bottom
R4  26.7,36.05 90 bottom
R5  30.58,15.81 180 bottom
R6  30.58,16.69 0 bottom
R7  25.2,23.55 180 top
R8  23.15,3.9 90 top
R9  23.15,2.9 270 bottom
R10  8.95,30.5 45 top
R11  7.2,29.65 270 top
R12  8.55,28.3 315 top
R13  20.75,31.8 180 bottom
R14  19.05,31.8 0 bottom
R15  15.5,12.5 0 bottom
R16  20,11.5 270 bottom
R17  24.5,12.5 180 bottom
SH1  16.23,13.89 90 bottom
SH2  19.85,15.74 90 bottom
SH3  23.37,14.08 90 bottom
TEMP1  30.5,1.4 0 top
TEMP2  32,1.4 0 top
TEMP3  33.5,1.4 0 top
U1  26,29 270 top
U3  20,20 180 bottom
U4  14,29 135 top
U$1  13.75,7.75 90 top
U$2  20,7.75 90 top
U$3  26.25,7.75 90 top
U$4  26.25,6.25 270 bottom
U$5  20,6.25 270 bottom
U$6  13.75,6.25 270 bottom
U$7  9.8,16.25 180 top
U$8  30.2,16.25 0 top
U$9  34.65,26.55 0 top
U$10  5.5,24.5 180 top
U$11  14.35,34.2 270 bottom
U$12  31,24 270 top

### Tracks (layer width: path | path; a pad name or v marks a point on that pad's centre or on a via)
3V3  (via drill 0.3, 0.35)
  Top 0.152: U4.26 18.63,30.45 C18.P$2 19.76,30.76 v19.8,30.76 | 29.6,24.85 C6.P$1 29.78,24.88 v29.45,24.55 | C7.P$2 31.54,32.47 | U1.1 29.5,32.45 C10.P$1 29.5,32.8 v29.75,32.55 C2.P$1 | 21.65,26.45 C1.P$1 v21.2,26.5 | 16.4,18.35 v16.7,18.35 | U$12.5 v31,22.2 31.1,22.1 C38.1 | v21.2,27.25 C4.P$1 | v21.2,28 C5.P$1 | C8.P$1 31.4,35.8 v31.4,35.45 | C9.P$1 30.5,35.55 v30.4,35.45 | 12.7,32.07 12.7,31.65 12.4,31.35 12,31.35 U4.42 11.15,32.2 11.15,33.65 12.5,35 v12.5,36.5 | 12.7,32.07 12.72,32.04 12.77,32.09 13.16,32.09 13.4,32.33 13.4,32.78 U4.38 | 12.7,32.07 U4.40
  Top 0.203: U1.35 28.25,25 28.4,24.85 29.6,24.85 | 30.05,31.75 30.55,31.75 | 30.55,31.75 30.82,31.75 31.54,32.47 | 30.3,32 30.05,31.75 | U1.48 30.05,31.75 | C2.P$1 30.3,32 | C5.P$1 21.9,28.25 U1.20 | U1.21 21.65,27.75 C4.P$1 21.65,26.75 U1.23 | v18.41,25.35 19,25.95 21.15,25.95 21.65,26.45 | v14.7,22.65 14.7,21.75 16.25,20.2 16.25,18.5 16.4,18.35 | 30.3,32 30.55,31.75 | R8.P$1 23.15,3.28 v22.37,2.5
  Top 0.305: J1.4 27.9,37.6 R2.P$1 R1.P$1 30.6,35.25 v31.4,34.45 31.74,34.11 C7.P$2
  Route2 0.152: v29.75,32.55 29.75,33.75 28.75,34.75 v27.65,34.75 | v27.65,34.75 30.06,34.75 30.06,34.76 30.2,34.76 v30.4,34.95 | v27.65,34.75 27.4,35 20,35 | 19.6,35 17.6,35 17.25,35.35 17.25,36.2 16.9,36.55 15.5,36.55 | 19.6,35 20,35 | 19.8,34.8 v19.8,30.76 21.2,29.36 v21.2,28 v21.2,27.25 v21.2,26.5 | 19.8,34.8 20,35 | 19.8,34.8 19.6,35
  Route2 0.203: v21.2,26.5 27.5,26.5 v29.45,24.55 31,23 v31,22.2 | TEMP1.P$1 27.55,4.3 24.17,4.3 v22.37,2.5 16,8.87 16,16.2 16.9,17.1 16.9,18.15 v16.7,18.35
  Bottom 0.152: 19.35,18.2 19.35,18.1 | U3.12 19.35,18 19.35,18.1 | 19.35,18.2 19.05,18.5 18.5,18.5 17.55,17.55 17.55,17.4 C12.P$1 17.35,17.7 v16.7,18.35 | v19.8,30.76 19.6,30.96 R14.P$1 R13.P$1 | 19.5,18.25 19.85,18.25 20,18.1 U3.11 | 19.5,18.25 19.4,18.25 19.35,18.2 | 19.35,18.1 19.5,18.25
  Bottom 0.203: v18.41,25.35 15.71,22.65 v14.7,22.65 | v27.65,34.75 27.45,34.75 R4.P$1 R3.P$1
  Bottom 0.305: P1.6 11.81,37.8
  Bottom 0.406: C3.1 10.38,38.05 11.96,38.05 P1.6 | 11.81,37.8 10.38,37.8 C11.1
  Bottom 0.508: P1.6 v12.01,36.51 v12,36.5
  other vias: 30.9,35.45 31.4,34.95 30.9,34.45 30.9,34.95 9.5,36.5 10,36.5 10.5,36.5 11,36.5 11.5,36.5 13,36.5 13.5,36.5 14,36.5 14.5,36.5 15,36.5 15.5,36.5
  pour Route2 (no thermals): 9,37.05 30.2,37.05 31.55,35.7 31.55,33.4 30.05,31.9 28,31.9 26.4,33.5 24.35,33.5 21.85,31 21.85,26.3 21.4,25.85 21.1,25.85 19.35,27.6 19.35,33.25 17.8,34.8 10,34.8 9,35.8
  pour Bottom (no thermals): 13.55,35.3 13.55,36.05 13.8,36.3 15.7,36.3 15.7,37 9.3,37 9.3,36.3 12.95,36.3 13.15,36.1 13.15,35.3
5V  (via drill 0.3, 0.35)
  Top 0.152: C39.1 28.6,22.75 28.35,23 U$12.3 | R11.P$1 7.8,30.8 7.8,33 7.8,33.2 7.8,34.3 8.35,34.85 v11.35,34.85
  Top 0.305: v27.4,23 U$12.3
  Route2 0.305: v18.5,27 22.8,22.7 v24.4,22.7
  Bottom 0.152: v11.35,34.85 11.82,34.38 L1.1
  Bottom 0.305: U$11.5 14.65,32.45 14.65,32.05 14.85,31.85 15.8,31.85 18.5,29.15 v18.5,27 | v24.4,22.7 25.14,22.7 25.53,23.08 26.62,23.08 26.7,23 v27.4,23
  pour Bottom (no thermals): 12.3,29.65 12.3,31.85 12.85,32.4 14.5,32.4 14.5,33.1 12.9,33.1 12.5,33.5 12.5,35.55 11.15,35.55 11.15,29.65 11.25,29.65 11.45,29.45 11.45,28.6 12.05,28.6 12.05,29.45 12.1,29.5
AS5047_A  (via drill 0.3)
  Top 0.152: v30.95,28.7 30.95,28.85 30.5,29.3 29.5,29.3 U1.43
  Bottom 0.152: U3.7 21.95,23.75 26.45,28.25 30.65,28.25 30.95,28.55 v30.95,28.7
AS5047_B  (via drill 0.3)
  Top 0.152: U1.42 v30.3,28.75
  Bottom 0.152: U3.6 21.3,23.65 26.4,28.75 v30.3,28.75
AS5047_CS  (via drill 0.3)
  Top 0.152: U1.24 22.35,26.25 21.5,25.4 19.25,25.4 18.35,24.5 v18.35,23.95
  Bottom 0.152: v18.35,23.95 18.35,23.87 18.05,23.57 U3.1
AS5047_MISO  (via drill 0.3)
  Top 0.152: U1.27 24.25,25.1 23.65,24.5 19.99,24.5 v19.6,24.11 v19.59,24.11
  Bottom 0.152: v19.59,24.11 19.35,23.87 U3.3
AS5047_MOSI  (via drill 0.3)
  Top 0.152: U1.28 24.75,25.1 23.8,24.15 20.45,24.15 v20.3,24
  Bottom 0.152: v20.3,24 20.3,23.97 20,23.67 U3.4
AS5047_SCK  (via drill 0.3)
  Top 0.152: U1.26 23.75,25.15 23.45,24.85 19.45,24.85 18.95,24.35 v18.95,24.2
  Bottom 0.152: v18.95,24.2 18.95,23.82 18.7,23.57 U3.2
CAN_N
  Top 0.152: U$12.6 31.05,23.05 32.12,23.05 32.61,23.54 32.61,24.76 33.2,25.35 33.9,25.35 34.65,24.6 U$9.P$2
  Bottom 0.152: U$10.P$2 5.5,25.7 5.25,25.45 4.8,25.45 4.15,26.1 4.15,26.75 4.75,27.35 5.7,27.35 9.31,23.74 10.61,23.74 12.71,21.64 27.54,21.64 28.8,22.9 30.65,22.9 33.44,25.69 34.16,25.69 34.65,25.2 U$9.P$2
CAN_P
  Top 0.152: U$12.7 31.05,23.45 31.95,23.45 32.2,23.7 32.2,24.93 33.03,25.76 33.9,25.76 34.65,26.51 U$9.P$1
  Bottom 0.152: U$10.P$1 5.18,24.5 3.74,25.93 3.74,26.92 4.58,27.76 5.87,27.76 9.47,24.15 10.78,24.15 12.88,22.05 27.38,22.05 28.63,23.31 30.48,23.31 33.27,26.1 34.2,26.1 U$9.P$1
CAN_RX
  Top 0.152: U1.33 27.25,24.85 26.75,24.35 26.75,22.85 27.1,22.5 U$12.4
CAN_TX
  Top 0.152: U1.34 27.75,24.8 28,24.55 U$12.1
CB
  Top 0.152: C20.P$1 10.49,31.45 U4.44
CUR1
  Top 0.152: U4.25 18.84,29.95 20.6,29.95 20.8,29.75 U1.17
CUR2
  Top 0.152: U4.24 18.59,28.3 19.45,28.3 20.4,29.25 U1.18
CUR3
  Top 0.152: U4.23 18.48,27.7 19.35,27.7 20.4,28.75 U1.19
DEBUG1
  Top 0.152: U1.3 27.75,33.1 28.45,33.8 DBG1.P$1
DEBUG2
  Top 0.152: U1.4 DBG2.P$1
DEBUG_RX  (via drill 0.3)
  Top 0.152: v31.3,27.75 U1.40
  Bottom 0.152: P1.3 16.5,38.4 17.25,39.15 29.35,39.15 32.15,36.35 32.15,28.6 v31.3,27.75
DEBUG_TX  (via drill 0.3)
  Top 0.152: v31.8,27.25 U1.39
  Bottom 0.152: P1.4 16.5,39.5 29.5,39.5 32.5,36.5 32.5,27.95 v31.8,27.25
DRV8323_CS  (via drill 0.3)
  Top 0.152: v22.01,32.54 21.66,32.89 16.83,32.89 U4.32 | U1.16 22.53,30.23 21.45,30.23 v21.05,30.63
  Bottom 0.152: v21.05,30.63 21.45,30.63 22.21,31.39 22.21,32.34 v22.01,32.54 21,33.55 DRV_CS.P$1
DRV8323_MISO  (via drill 0.3)
  Top 0.152: U1.14 21.9,31.25 v21.6,31.55 | v20.65,31.12 20.47,31.3 17.36,31.3 U4.29
  Bottom 0.152: v20.65,31.12 21.17,31.12 v21.6,31.55 21.55,31.55 R13.P$2 19.5,33.6 DRV_MISO.P$1
DRV8323_MOSI  (via drill 0.3)
  Top 0.152: U1.15 21.7,30.75 20.85,31.6 17.75,31.6 v17.5,31.85 17.35,31.7 17.05,31.7 U4.30
  Bottom 0.152: v17.5,31.85 18.65,33 18.65,35.22 18,35.72 DRV_MOSI.P$1
DRV8323_SCLK  (via drill 0.3)
  Top 0.152: U4.31 17.25,32.6 21.25,32.6 22.1,31.75 U1.13 22.7,31.9 v22.7,32.35
  Bottom 0.152: DRV_SCK.P$1 21.75,35 21.75,33.75 22.7,32.8 v22.7,32.35
FB
  Top 0.152: U4.1 9.56,28.45 9.32,28.69 R12.P$1 7.71,28.69 7.3,29.1 R11.P$2
GHA  (via drill 0.3)
  Top 0.152: U4.8 11.8,25.74 11.8,23.35 12.25,22.9 12.25,20.15 12.6,19.8 v12.6,19.7 | v16.9,6.05 16.9,5.75 16.25,5.1 U$1.4
  Bottom 0.152: v16.9,6.05 16.9,7.45 16.4,7.95 11.55,7.95 10.9,8.6 10.9,12.25 13.8,15.15 13.8,19.35 13.45,19.7 v12.6,19.7
GHB  (via drill 0.3)
  Top 0.152: U4.17 16.2,25.74 16.2,22.05 17.65,20.6 17.65,20.1 v17.75,20 | v23.15,5.5 22.66,5.5 22.43,5.27 22.07,5.26 U$2.4
  Bottom 0.152: v17.75,20 22.15,20 29.95,12.2 29.95,8.95 29,8 23.75,8 23.15,7.4 v23.15,5.5
GHC  (via drill 0.3)
  Top 0.152: U4.18 16.53,26.12 16.53,22.17 v18.23,20.48 | v29.5,5.15 28.21,5.15 U$3.4
  Bottom 0.152: v18.23,20.48 22.12,20.48 30.23,12.37 30.23,7.73 30.2,7.71 30.2,5.85 v29.5,5.15
GLA  (via drill 0.3)
  Top 0.152: U4.10 12.43,24.95 12.43,24.05 12.95,23.52 12.95,20.6 13.4,20.15 14.1,20.15 v14.7,19.55
  Bottom 0.152: v14.7,19.55 14.7,14.65 15.66,13.7 U$6.4
GLB  (via drill 0.3)
  Top 0.152: U4.15 15.5,25.02 15.5,21.94 16.92,20.52 16.92,19.27 17.27,18.92 v17.82,18.92
  Bottom 0.152: v17.82,18.92 18.02,19.12 21.83,19.12 24.45,16.5 24.45,11 22.36,8.9 U$5.4
GLC  (via drill 0.3)
  Top 0.152: U4.20 17.25,26.81 17.25,22.7 18.35,21.61 18.39,21.61 18.39,21.6 22.19,21.6 v22.77,21.02
  Route2 0.152: v31.25,11.21 28.8,8.76 v28.8,8.75
  Bottom 0.152: v22.77,21.02 30.9,12.89 30.9,11.56 v31.25,11.21 | v28.8,8.75 28.64,8.9 U$4.4
GND  (via drill 0.3)
  Top 0.152: U$12.2 29.25,23.5 U$12.9 29.5,23.3 30.2,24 U$12.8 | U4.35 15.12,33.3 16,33.3 C17.P$1 | v30,20.8 29.9,20.9 C38.2 | U4.43 13.65,29 U4.PAD v10.8,29 10.8,28.98 U4.2 9.44,27.62 9.23,27.62 R12.P$2 | v24.65,24.3 25.05,24.3 C13.P$2 24.95,24.2 24.95,23.9 24.65,23.6 R7.P$2 | U4.27 17,29.52 v17,29 | v19.9,29.45 19.8,29.35 C18.P$1 | C10.P$2 29.65,34.3 v30.25,34.3
  Top 0.203: U1.38 28.25,26.75 U1.49
  Bottom 0.152: R9.P$2 22.65,1.85 v22.65,1.72 | R6.P$1 30.5,17.32 30.5,20.55 30.25,20.8 v30,20.8 | SH1.2 16.9,13.09 R15.1 | U3.13 v18.7,17.9
  other vias: 20.65,23.42 17.05,33.85 14,29 15,29 16,29 16,28 14,26 13,27 12,28 15,27 14,28 14,30 14,31 14,31.95 15,31 16,30 15,30 13,31 13,30 13,28 14,27 15,28 16.85,15.8 17.35,15.8 17.85,15.8 18.35,15.8 18.85,15.8 19.35,15.8 19.35,15.3 18.85,15.3 18.35,15.3 17.85,15.3 17.35,15.3 16.85,15.3 16.85,14.8 17.35,14.8 17.85,14.8 18.35,14.8 18.85,14.8 20.35,15.8 20.35,15.3 20.85,15.3 20.85,15.8 21.35,15.8 21.35,15.3 21.35,14.8 20.85,14.8 19.35,14.8 19.85,14.8 20.35,14.8 21.85,15.8 22.35,15.8 22.85,15.8 22.85,15.3 22.35,15.3 21.85,15.3 21.85,14.8 22.35,14.8 22.85,14.8 19.85,15.3 19.85,15.8 11.75,20.7 31.2,33.5 31.6,28.85 33.15,30.7 33.15,29.65 6.65,9.65 6.65,8.65 5.65,8.65 5.65,9.65 4.65,9.65 4.65,8.65 3.65,8.65 3.65,9.65 2.65,9.65 2.65,8.65 2.65,7.65 1.65,7.65 1.65,8.65 1.65,9.65 33.65,9.65 33.65,8.65 34.65,8.65 34.65,9.65 35.65,9.65 35.65,8.65 36.65,8.65 36.65,9.65 37.65,9.65 37.65,8.65 38.65,9.65 38.65,8.65 38.65,7.65 37.65,7.65 33.4,24.35 9.5,1 8.5,1 7.5,1 6.5,1 6.5,2 7.5,2 17,2.5 29,2 33,2.5 32.5,3 29,1 38.65,33.15 33.15,38.65 8.4,36.5 5.8,29.25 1.15,33.15 7.4,37.55 31.65,38.65 28.15,11.65 27.15,19.15 6.8,24.25 7.65,22.65 4.15,22.65 24.2,31 27.7,31 25.9,31 24.2,29.1 24.05,27.35 27.8,27.15 26.15,27.15 27.75,29.25 25.9,29.05 23.75,23.65 14.7,23.28 19.95,27.6 19.15,27.2 18.5,26.2 11.75,19 12.25,19 11.75,18.5 11.75,18 11.75,17.5 11.75,17 12.25,17 12.25,17.5 12.25,18 12.25,18.5 12.75,18.5 12.75,18 12.75,17.5 12.75,17 11.75,16.5 12.25,16.5 12.75,16.5 28.65,19.65 28.15,19.65 27.65,19.65 27.65,19.15 28.15,19.15 28.65,19.15 28.65,18.65 28.15,18.65 27.65,18.65 28.15,18.15 28.65,18.15 27.65,18.15 27.15,18.65 26.65,19.15 26.65,19.65 27.15,19.65 7.3,31.8 31.55,25.25 33.4,23.4 32,22.35 4.8,29.25 5.8,31.75 4.8,31.75 7.4,39.05 6.4,39.05 6.4,37.55 31.2,19.95 31.2,17.6 8.75,20 8.8,17.7
  pour Bottom (no thermals): 15.55,12.41 16.81,11.15 23.15,11.15 24.35,12.35 24.35,13.45 23.7,13.45 23.4,13.75 23.4,16.3 16.5,16.3 16.5,13.3 15.55,13.3
  pour Top (isolate 0.203, rank 4): -2.5,20.5 -2.5,41.5 -0.5,43.5 42.5,43.5 42.5,20.5 22.75,20.5 22.75,20 31.9,20 31.9,10.7 39.85,10.7 39.85,5.95 33.95,0.05 6.15,0.05 0.1,6.1 0.1,10.7 8.1,10.7 8.1,20 17.25,20 17.25,20.5
  pour Bottom (isolate 0.203, rank 4): -2.5,20.5 -2.5,39.75 1.25,43.5 42.5,43.5 42.5,20.5 22.75,20.5 22.75,20 31.9,20 31.9,10.7 39.85,10.7 39.85,5.9 34,0.05 6.05,0.05 0.1,6 0.1,10.7 8.1,10.7 8.1,20 16.75,20 16.75,20.5
  pour Route2 (isolate 0.203, rank 4): -2.5,20.5 -2.5,37.75 3.25,43.5 42.5,43.5 42.5,20.5 22.75,20.5 22.75,20 31.9,20 31.9,10.7 39.85,10.7 39.85,5.95 34,0.1 6,0.1 0.1,6 0.1,10.7 8.1,10.7 8.1,20 17.25,20 17.25,20.5
  pour Route15 (isolate 0.203, rank 4, no thermals): -2.5,20.5 -2.5,38.75 2.25,43.5 42.5,43.5 42.5,20.5 22.75,20.5 22.75,20 31.9,20 31.9,10.7 39.85,10.7 39.85,5.9 34,0.05 6.1,0.05 0.1,6.05 0.1,10.7 8.1,10.7 8.1,20 17.25,20 17.25,20.5
  pour Top (no thermals): 8.6,20.2 11.05,20.2 12.95,18.3 13.3,17.95 25.75,17.95 26.9,17.95 29.1,20.15 31.75,20.15 31.8,20.1 31.8,17.25 28.4,17.25 28,16.85 28,15.5 27.1,14.6 12.95,14.6 12,15.55 10.75,16.8 8.65,16.8 8.65,20.15
  pour Top (rank 3, no thermals): 0.1,10.7 8.5,10.7 8.5,4 31.5,4 31.5,10.7 39.85,10.7 39.85,5.9 33.95,0 6.1,0 0.1,6
LED1
  Top 0.152: D3.CATHODE 26.15,33.75 26.75,33.15 U1.5
LED2
  Top 0.152: U1.6 26.25,33 25.1,34.15 D2.CATHODE
MOTOR1
  Top 0.152: U1.10 24.25,33.05 23.35,33.95 MOT1.P$1 17.6,33.95 17.15,34.4 14.49,34.4 U4.37
MOTOR2  (via drill 0.35)
  Top 0.152: U1.9 24.75,33 23.05,34.7 18,34.7 | U4.39 12.3,33.17 12.3,33.55 13.45,34.7 18,34.7 | 18,34.7 v18,34.5
  Bottom 0.152: v18,34.5 17.75,34.5 MOT2.P$1
MOTOR3
  Top 0.152: U1.8 25.2,32.5 25.2,33 23.32,34.88 | 23.22,34.98 13.28,34.98 12,33.7 12,32.95 11.8,32.75 11.8,32.25 12,32.05 12,31.99 U4.41 | 23.32,34.88 23.22,34.98 | MOT3.P$1 23.32,35.08 | 23.32,35.08 23.23,34.98 23.22,34.98 | 23.32,35.08 23.32,34.88
MOTOR_ENABLE
  Top 0.152: U1.11 23.65,32.55 23.65,32.95 23.4,33.2 16.43,33.2 U4.33
MOTOR_FAULT  (via drill 0.3)
  Top 0.152: U4.28 17.67,30.9 18.2,30.9 v18.3,30.8 | v30.4,29.78 30.37,29.75 U1.44
  Bottom 0.152: v30.4,29.78 30.08,30.1 19,30.1 v18.3,30.8 18.5,31 R14.P$2
N$5
  Top 0.152: U4.48 9,30.11 R10.P$1
N$10
  Top 0.152: U4.3 9.81,27.29 C16.P$2
N$13
  Top 0.152: U4.4 10.61,27.43 10.14,26.96 9.69,26.96 C16.P$1
N$14
  Top 0.152: U4.5 10.91,27.07 10.29,26.45 C15.P$2
N$16
  Top 0.152: C17.P$2 14.96,33.85 U4.36
N$17
  Top 0.152: R1.P$2 26.6,35.25 D3.ANODE
N$18
  Top 0.152: R2.P$2 27.3,36 26.95,36.35 25.65,36.35 25.1,35.8 D2.ANODE
SCL  (via drill 0.3)
  Top 0.152: U1.46 v30.35,30.75
  Bottom 0.152: v30.35,30.75 31.6,30.75 31.8,30.95 31.8,32.05 27.25,36.6 R4.P$2 26.45,36.85 26.45,37.95 J1.3
SDA  (via drill 0.3)
  Top 0.152: U1.47 31.1,31.25 v31.25,31.4
  Bottom 0.152: v31.25,31.4 31.25,32.1 27.25,36.1 25.95,36.1 R3.P$2 24.95,37.1 24.95,37.95 J1.2
SHA  (via drill 0.3)
  Top 0.152: U4.9 12.15,25.38 12.15,23.7 12.6,23.25 12.6,20.45 13.3,19.75 v13.3,19.2
  Bottom 0.152: v13.3,19.2 13.3,15.1 10.45,12.25 10.45,7 13.07,4.38 U$6.7
  Bottom 0.305: A.1 12.25,2.05 DA.P$1
  pour Top (no thermals): 11.55,5.5 10.7,4.65 10.7,0.85 11.2,0.35 15.1,0.35 15.6,0.85 15.6,3.1 14.7,4 14.7,5.5
  pour Bottom (no thermals): 11.55,4 11.55,1.1 12.35,0.3 15.25,0.3 16,1.05 16,4
SHB  (via drill 0.3)
  Top 0.152: U4.16 15.86,25.37 15.86,21.99 17.25,20.6 17.25,19.6 v17.4,19.45
  Bottom 0.152: v17.4,19.45 22.15,19.45 24.8,16.8 24.8,10.85 23.15,9.2 23.15,7.85 20.64,5.34 U$5.6
  Bottom 0.305: B.1 18.45,2.05 DB.P$1
  pour Top (no thermals): 17.8,5.55 17.8,1.5 18.9,0.4 21.2,0.4 21.75,0.95 21.75,3.8 21,4.55 21,5.55
  pour Bottom (no thermals): 17.8,4.05 17.8,1.4 18.85,0.35 18.9,0.3 21.3,0.3 22.2,1.2 22.2,4 17.85,4
SHC  (via drill 0.3)
  Top 0.152: U4.19 16.91,26.45 16.91,22.39 18.35,20.95 v18.8,20.95
  Bottom 0.152: v18.8,20.95 22.2,20.95 30.6,12.55 30.6,5.35 29.55,4.3 28.46,4.3 28.16,4 U$4.5
  Bottom 0.305: C.1 24.75,2.05 DC.P$1
  pour Top (no thermals): 24.05,5.5 24.05,1.3 24.9,0.45 25.05,0.3 27.5,0.3 28.1,0.9 28.1,2.6 28.1,3.7 27.25,4.55 27.25,5.55 24.05,5.55
  pour Bottom (no thermals): 24.1,4 24.1,1.15 24.95,0.3 27.6,0.3 28.3,1 28.45,1.15 28.45,4
SNA  (via drill 0.3)
  Top 0.152: U4.12 13.75,24.34 13.75,21.3 v14.65,20.4
  Bottom 0.152: SH1.1 15.33,14.92 15.33,19.72 v14.65,20.4
SNB  (via drill 0.3)
  Top 0.152: U4.13 14.2,24.29 14.2,21.55 v15.4,20.35
  Bottom 0.152: v15.4,20.35 15.75,20 15.75,16.7 16.2,16.25 19.57,16.25 19.85,15.97 SH2.1
SNC  (via drill 0.3)
  Top 0.152: U4.22 17.95,27.52 17.95,24.8 17.89,24.75 17.89,22.95 18.36,22.49 23.06,22.49 v24.55,21
  Route2 0.152: v28.55,16.75 26.7,14.9 v23.55,14.9
  Bottom 0.152: v28.55,16.75 28.2,16.75 24.55,20.4 v24.55,21 | v23.55,14.9 23.37,14.72 SH3.1
SPA  (via drill 0.3)
  Top 0.152: U4.11 12.83,24.65 12.83,24.25 13.33,23.75 13.33,20.92 v13.6,20.65
  Bottom 0.152: R15.2 14.1,12.67 14.14,12.68 14.14,20.11 v13.6,20.65
  pour Bottom (no thermals): 11.55,8.5 11.55,12 13.3,13.75 14.9,13.75 15.2,13.45 15.2,9.8 14.85,9.45 14.7,9.3 14.7,8.5
SPB  (via drill 0.3)
  Top 0.152: U4.14 15.15,24.67 15.15,21.84 16.59,20.4 16.59,19.11 17.25,18.45 v17.35,18.45
  Bottom 0.152: v17.35,18.45 18.05,18.45 18.4,18.8 21.5,18.8 24.13,16.16 24.13,11.09 23.15,10.1 R16.2
  pour Bottom (no thermals): 18.65,10.85 17.8,10 17.8,8.5 21.25,8.5 21.25,10.85
SPC  (via drill 0.3)
  Top 0.152: U4.21 17.34,27.2 17.59,26.96 17.59,22.81 18.45,21.95 22.62,21.95 v23.55,21.02
  Route2 0.152: v29.05,16.07 27.95,14.98 v27.95,12.35
  Bottom 0.152: v29.05,16.07 28.43,16.07 23.55,20.95 v23.55,21.02 | v27.95,12.35 26.25,12.35
  pour Bottom (no thermals): 25.15,13.8 25.15,10.8 24.1,9.75 24.1,8.5 24.15,8.45 27.15,8.45 27.15,13.3 26.65,13.8
SW  (via drill 0.3)  (1 unrouted)
  Top 0.152: U4.45 10.65,30.57
  Top 0.305: 10.65,30.57 9.76,31.46 C20.P$2
  Bottom 0.152: L1.2 9,33.63 v9,33.5
  other vias: 8.5,32.5 9,32.5 9.5,32.5 9,32 8.5,32 8.5,33 9,33 9.5,33 9.5,32 9.5,33.5 8.5,33.5
  pour Top (no thermals): 10.05,31.45 10.05,31.8 9.7,32.15 9.7,33.15 8.25,33.15 8.25,31.8 9.1,31.8 9.75,31.15
  pour Bottom: 7.95,35.6 9.6,35.6 9.6,31.5 10.25,30.85 10.25,29.7 7.8,29.7 7.8,35.45
SWCLK  (via drill 0.3)
  Top 0.203: v33.8,31.55 34.1,31.25 34.1,28.55 31.8,26.25 U1.37
  Route2 0.203: P1.1 20.55,39.05 29.1,39.05 31.95,36.2 31.95,33.4 v33.8,31.55
SWDIO  (via drill 0.3)
  Top 0.203: v34.66,31.5 34.66,28.16 32.26,25.76 29.38,25.76 29.18,25.55 U1.36
  Route2 0.203: P1.2 18,38.75 18.75,39.5 29.5,39.5 32.71,36.29 32.71,33.4 34.63,31.48 v34.66,31.5
V+  (via drill 0.3)
  Top 0.127: C14.P$1 8.45,31.2 8.9,31.2
  Top 0.152: v11,25.95 11,26.35 U4.6 | U4.47 9.34,30.48 R10.P$2 9.03,31.2 8.9,31.2 8.6,31.2 7.94,30.54 7.94,29.68 8.45,29.17 v8.9,29.17
  Bottom 0.152: v8.9,29.17 9.88,29.17 11,28.05 v11,25.95 | U$8.V+@1 32.3,13.75 31.15,14.9 31.15,15.79 R5.P$2
  other vias: 10,23 10.5,23 10.5,22.5 10,22.5 10,22 10.5,22 10.5,21.5 10,21.5 10,21 10.5,21 11,21 11,21.5 11,22 11,22.5 9,15.5 9.5,15.5 10,15.5 10.5,15.5 10.5,16 10,16 9.5,16 9,16 31.4,15 31.45,12.55 8.8,12.55 8.8,14.8
  pour Top (no thermals): 11.57,27.07 9.65,25.15 9.65,21 9.87,20.78 11.18,20.78 11.45,21.05 11.45,25.9 12.1,26.55
  pour Bottom (no thermals): 11.3,22.5 10.55,23.25 9.6,23.25 8.45,22.1 8.45,12.2 9.45,12.2 11.3,14.05
  pour Top (rank 2, no thermals): 8.1,15.15 8.1,15.95 8.35,16.2 10.6,16.2 12.7,14.1 27.2,14.1 28.25,15.15 31.7,15.15 31.7,11.15 31.05,10.5 31.05,6.9 31.8,6.15 31.8,5.6 8.15,5.6 9.15,6.6 9.15,10.95 8.05,12.05 8.05,15.1
VBAT_SENSE  (via drill 0.3)
  Top 0.152: v26.4,21.1 26.4,21.5 26.05,21.85 24.2,21.85 22.93,23.12 v22.93,23.57 | v22.53,25.67 23.13,25.67 U1.25
  Route2 0.152: v22.53,25.67 22.93,25.27 v22.93,23.57
  Bottom 0.152: R5.P$1 R6.P$2 30.03,19.67 28.6,21.1 v26.4,21.1
VTEMP_FET  (via drill 0.3)
  Top 0.152: v23.15,4.85 R8.P$2 | U1.31 C13.P$1
  Top 0.203: C13.P$1 26.25,22.95 26.4,22.8 v26.4,22.55
  Route2 0.203: v23.15,4.85 23.3,4.85 27.5,9.05 27.5,10 30,12.5 30,19 26.45,22.55 v26.4,22.55
  Bottom 0.152: v23.15,4.85 R9.P$1
VTEMP_MOT  (via drill 0.3)
  Top 0.152: U1.30 R7.P$1
  Top 0.203: v25.75,22.55 R7.P$1
  Route2 0.203: TEMP2.P$1 28,5.4 28,9.5 30.5,12 30.5,21.5 27.5,24.5 26.5,24.5 25.75,23.75 v25.75,22.55

### Text on the board
tPlace: CANL / CANH | CANH / CANL | OpenLeg Drive | Joey Byrnes | v1.0 | HW based on Moteus & HKC | C | A | B | C | 3v3 | TMP | GND
bPlace: 3v3 | GND | TX | RX | IO | CLK | GND | SDA | SCL | 3v3 | M2 | MO | MI | CS | SCK | M3 | M1 | DBG2 | DBG1 | GitHub.com/JoeyByrnes | L / H | H / L